# Altium project X98_CARRIER_V1R2.PrjPcb (part 1 of 3)
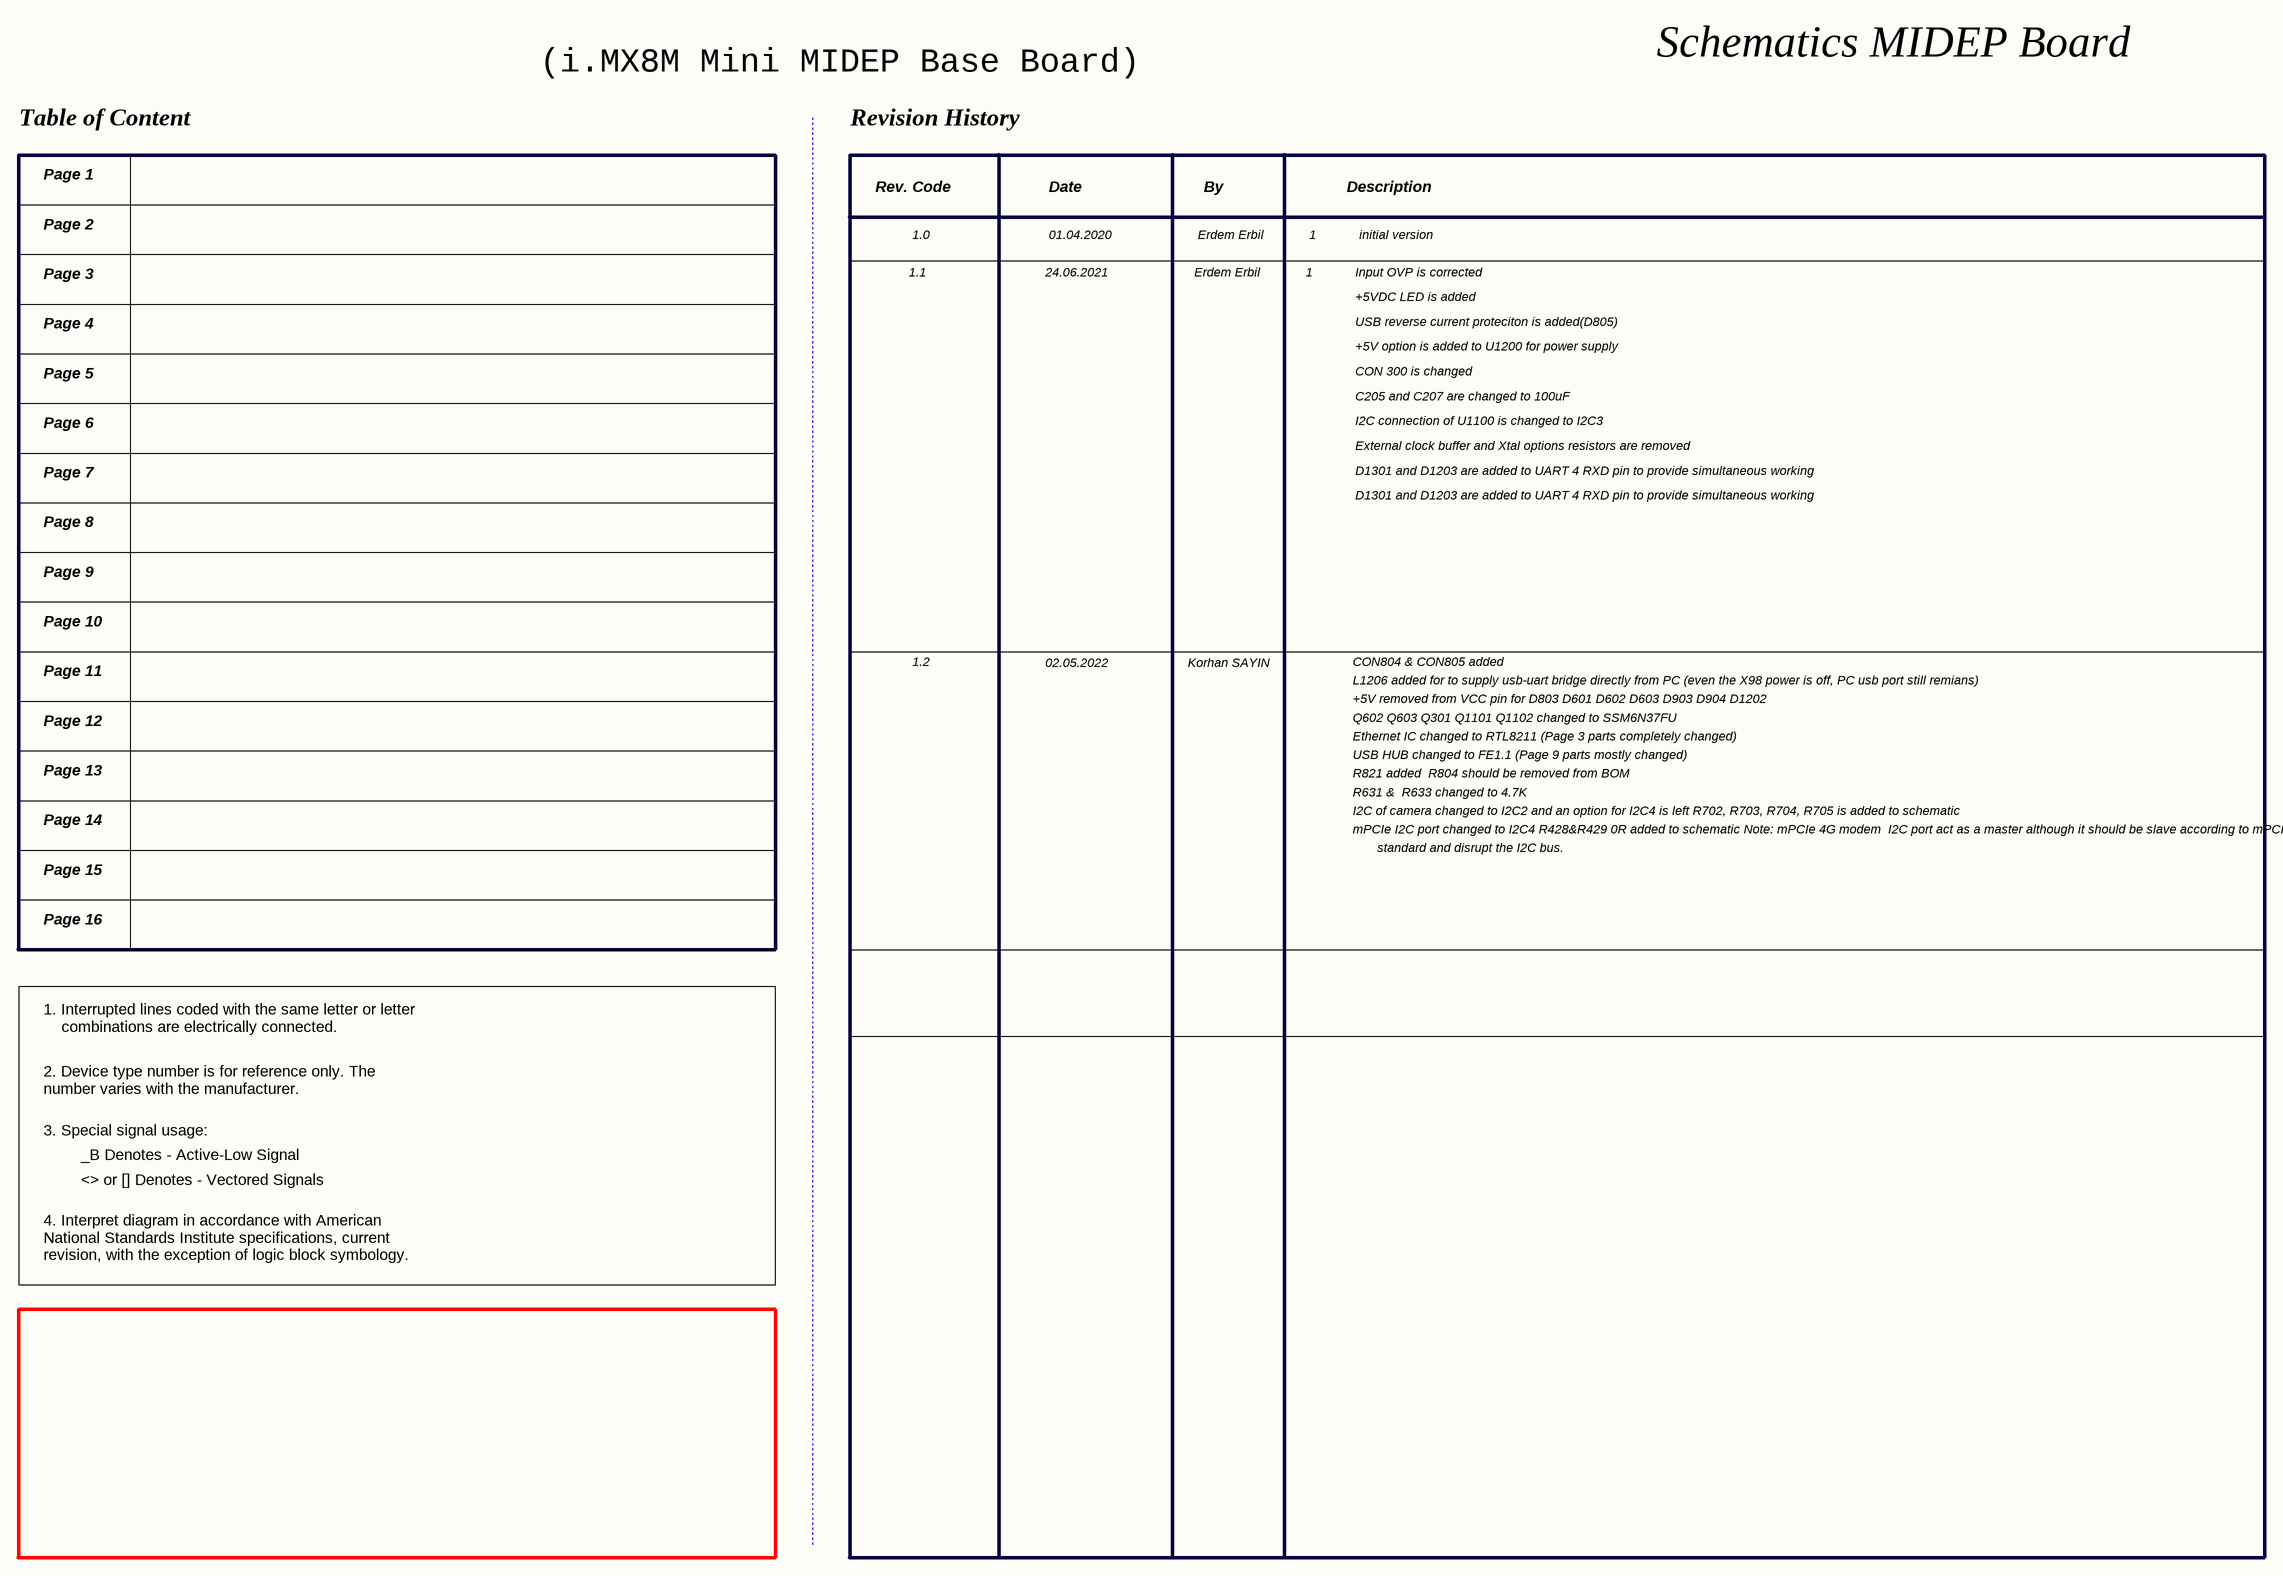
[diagram p0: 00 COVER.SchDoc]
13 sheets, 379 parts. Net scope: global (net labels, ports and power ports of the same name join across sheets).
Board file: PCB1.PcbDoc
Sheets:
  00 COVER.SchDoc
  00 BLOCK DIAGRAM.SchDoc
  MAIN.SchDoc
    Designator = 01 SoM IO INTERFACE.SchDoc
    Designator = 07 MIPI CSI.SchDoc
    Designator = 08 USB OTG & POWER.SchDoc
    Designator = 10 BOOT.SchDoc
    Designator = 05 MICROSD.SchDoc
    Designator = 06 MIPI-DSI to HDMI.SchDoc
    Designator = 12 CONSOLE.SchDoc
    Designator = 04 Custom.SchDoc
    Designator = 09 USB HUB.SchDoc
  00 PCB SPEC.SchDoc

## Sheet 00 COVER.SchDoc
size A2

### Notes on the sheet
- (i.MX8M Mini MIDEP Base Board)
- Schematics MIDEP Board
- Table of Content
- Revision History
- Page 1
- Rev. Code
- Date
- By
- Description
- Page 2
- 1.0
- 01.04.2020
- Erdem Erbil
- 1
- initial version
- Page 3
- Page 4
- 1.1
- 24.06.2021
- Input OVP is corrected
- +5VDC LED is added
- USB reverse current proteciton is added(D805)
- Page 5
- +5V option is added to U1200 for power supply
- CON 300 is changed
- Page 6
- C205 and C207 are changed to 100uF
- I2C connection of U1100 is changed to I2C3
- External clock buffer and Xtal options resistors are removed
- Page 7
- D1301 and D1203 are added to UART 4 RXD pin to provide simultaneous working
- Page 8
- Page 9
- Page 10
- Page 11
- 1.2
- 02.05.2022
- Korhan SAYIN
- CON804 & CON805 added
- L1206 added for to supply usb-uart bridge directly from PC (even the X98 power is off, PC usb port still remians)
- +5V removed from VCC pin for D803 D601 D602 D603 D903 D904 D1202
- Page 12
- Q602 Q603 Q301 Q1101 Q1102 changed to SSM6N37FU
- Ethernet IC changed to RTL8211 (Page 3 parts completely changed)
- USB HUB changed to FE1.1 (Page 9 parts mostly changed)
- Page 13
- Page 14
- R821 added  R804 should be removed from BOM
- R631 &  R633 changed to 4.7K
- I2C of camera changed to I2C2 and an option for I2C4 is left R702, R703, R704, R705 is added to schematic
- Page 15
- mPCIe I2C port changed to I2C4 R428&R429 0R added to schematic Note: mPCIe 4G modem  I2C port act as a master although it should be slave according to mPCIe
- standard and disrupt the I2C bus.
- Page 16
- 1. Interrupted lines coded with the same letter or letter
  combinations are electrically connected.
- 2. Device type number is for reference only. The
  number varies with the manufacturer.
- 3. Special signal usage:
- _B Denotes - Active-Low Signal
- <> or [] Denotes - Vectored Signals
- 4. Interpret diagram in accordance with American
  National Standards Institute specifications, current
  revision, with the exception of logic block symbology.
- Sheet Title:
- Project:
- Inventron
- Electronics and Software
- Size:
- Date:
- Drawn By:
- Revision:
- Checked By:
- A4
- Sheet
- Time:
- of
- Budotek Teknopark
- Dudullu OSB
- Des 2. Cadde No:8/30
- ©2020 Inventron Electronics and Software. All rights reserved.
- Umraniye / ISTANBUL

## Sheet 00 BLOCK DIAGRAM.SchDoc
size A3
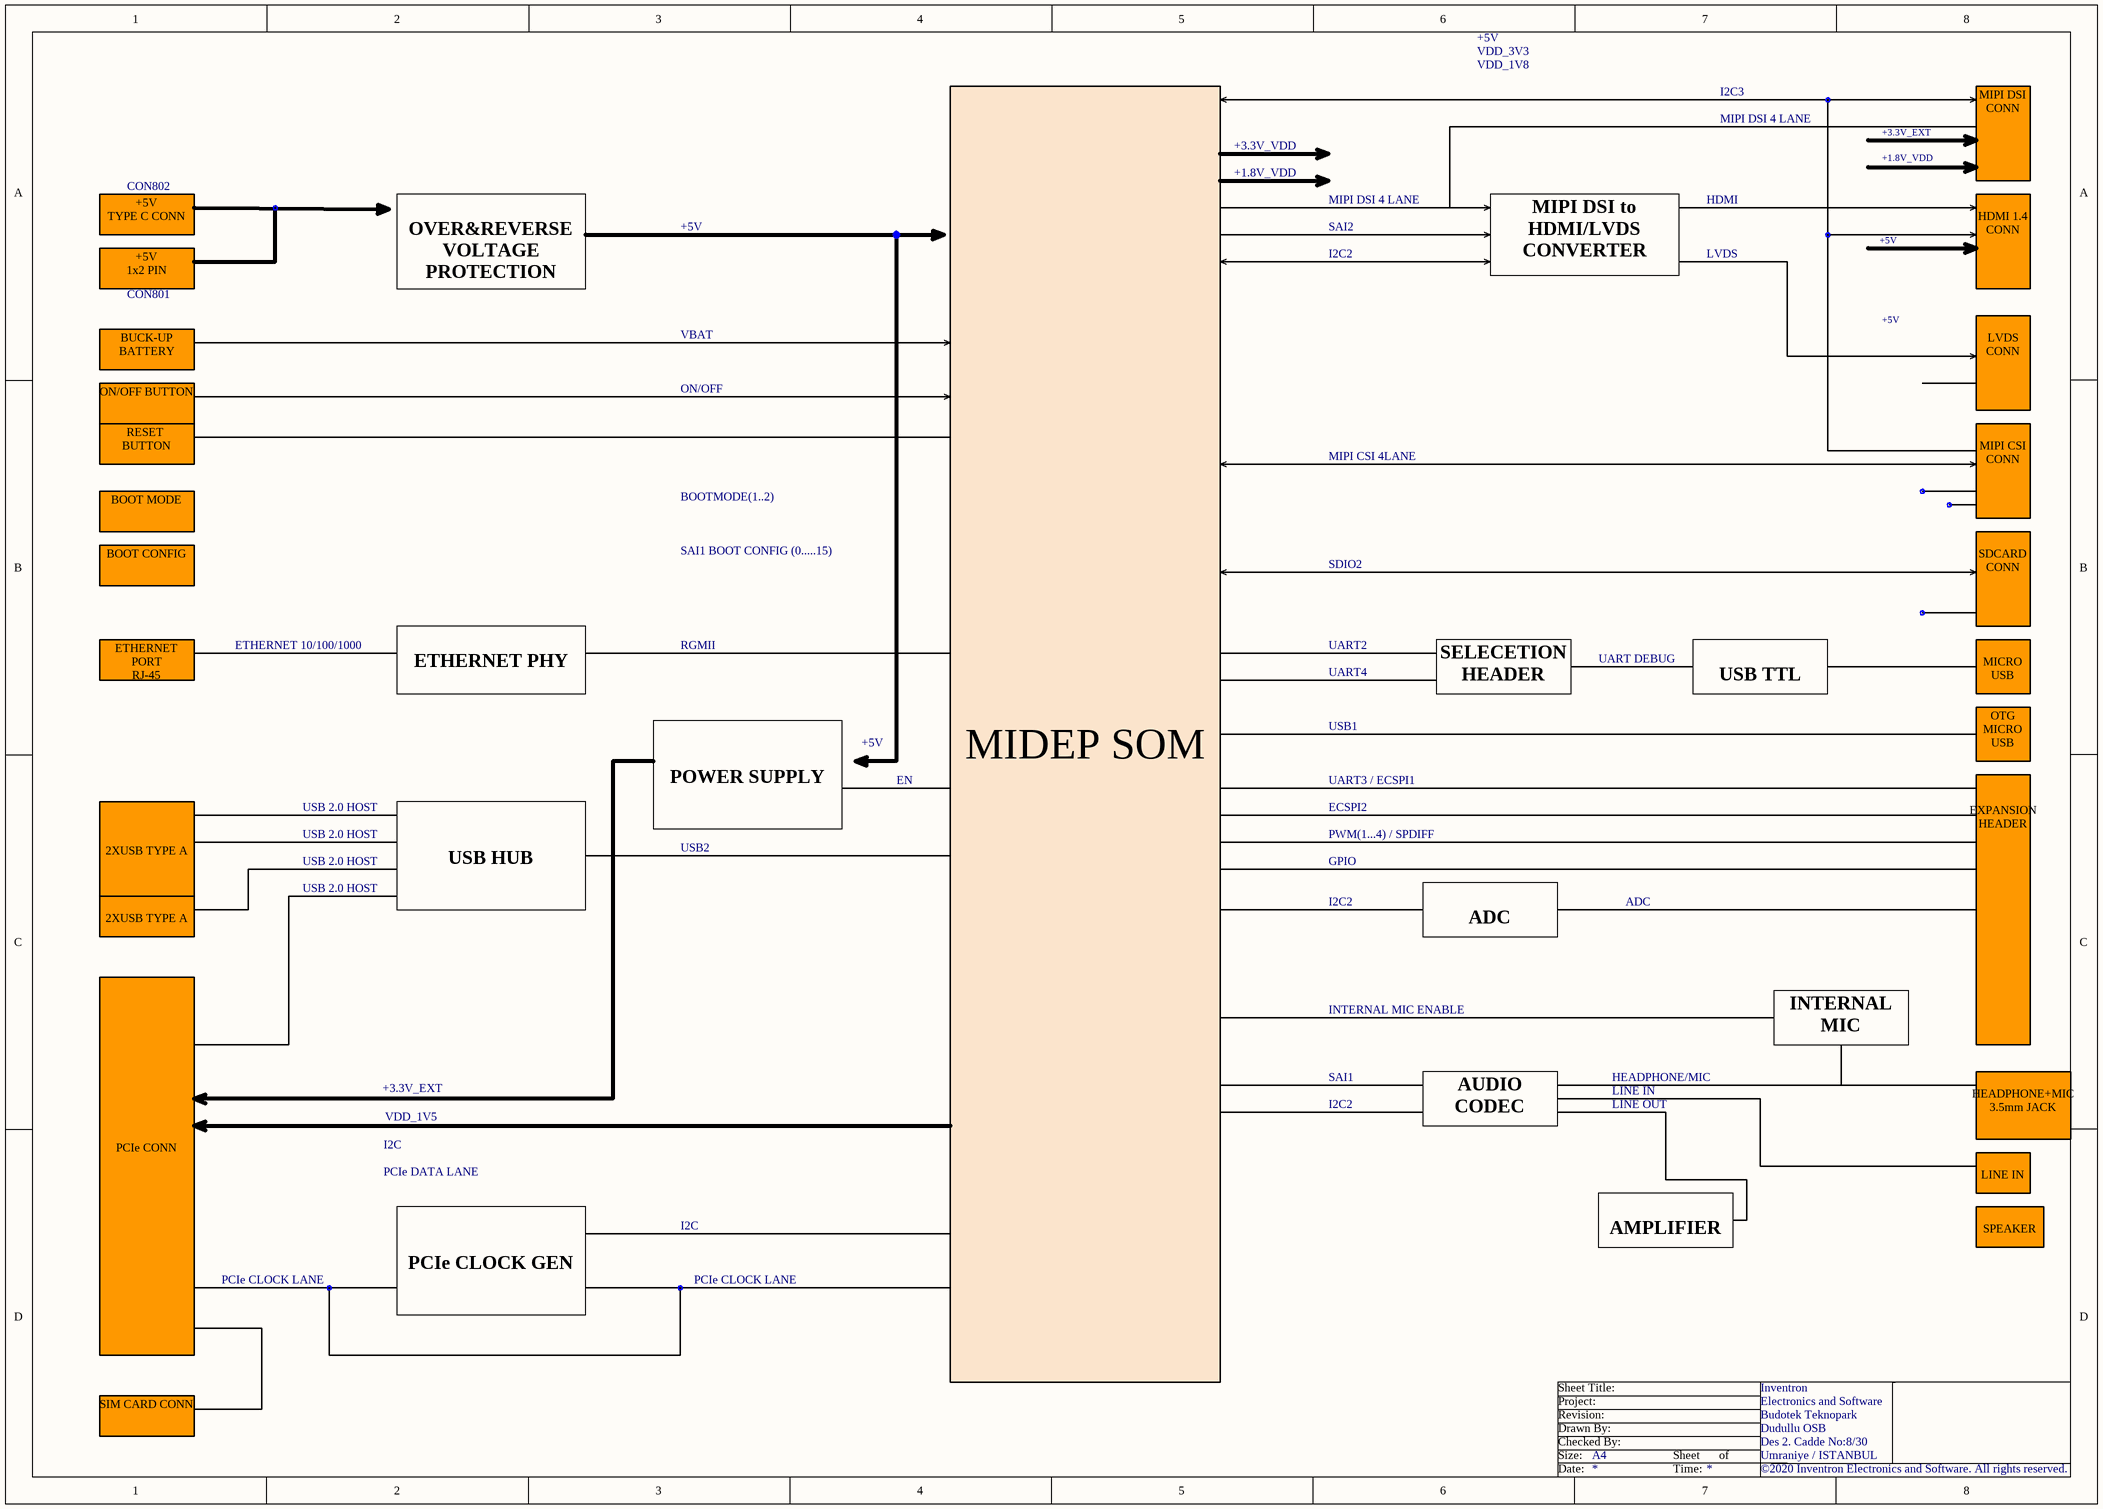
[diagram p1: 00 BLOCK DIAGRAM.SchDoc]

### Notes on the sheet
- +5V
- VDD_3V3
- VDD_1V8
- I2C3
- +3.3V_VDD
- +1.8V_VDD
- MIPI DSI 4 LANE
- +3.3V_EXT
- MIPI DSI CONN
- +5V
  TYPE C CONN
- CON802
- SAI2
- HDMI
- +5V
  1x2 PIN
- CON801
- OVER&REVERSE VOLTAGE
  PROTECTION
- I2C2
- MIPI DSI to HDMI/LVDS CONVERTER
- LVDS
- HDMI 1.4 CONN
- BUCK-UP BATTERY
- VBAT
- ON/OFF BUTTON
- ON/OFF
- LVDS CONN
- RESET
  BUTTON
- BOOTMODE(1..2)
- MIPI CSI 4LANE
- MIPI CSI CONN
- BOOT MODE
- BOOT CONFIG
- SAI1 BOOT CONFIG (0.....15)
- SDIO2
- ETHERNET 10/100/1000
- RGMII
- UART2
- SDCARD CONN
- ETHERNET PORT
  RJ-45
- ETHERNET PHY
- UART4
- SELECETION HEADER
- UART DEBUG
- USB TTL
- MICRO USB
- EN
- UART3 / ECSPI1
- USB1
- OTG
  MICRO USB
- USB 2.0 HOST
- POWER SUPPLY
- USB2
- ECSPI2
- PWM(1...4) / SPDIFF
- 2XUSB TYPE A
- USB HUB
- GPIO
- ADC
- INTERNAL MIC ENABLE
- INTERNAL MIC
- EXPANSION HEADER
- VDD_1V5
- SAI1
- AUDIO CODEC
- HEADPHONE/MIC
- LINE IN
- LINE OUT
- I2C
- PCIe DATA LANE
- HEADPHONE+MIC
  3.5mm JACK
- AMPLIFIER
- SPEAKER
- PCIe CLOCK LANE
- PCIe CLOCK GEN
- PCIe CONN
- MIDEP SOM
- SIM CARD CONN
- Sheet Title:
- Inventron
- Size:
- Drawn By:
- Revision:
- Project:
- Checked By:
- A4
- Sheet
- of
- Budotek Teknopark
- Dudullu OSB
- Des 2. Cadde No:8/30
- Umraniye / ISTANBUL
- Electronics and Software
- Date:
- Time:
- ©2020 Inventron Electronics and Software. All rights reserved.

## Sheet MAIN.SchDoc
size A3; SheetNumber: 1; SheetTotal: 11
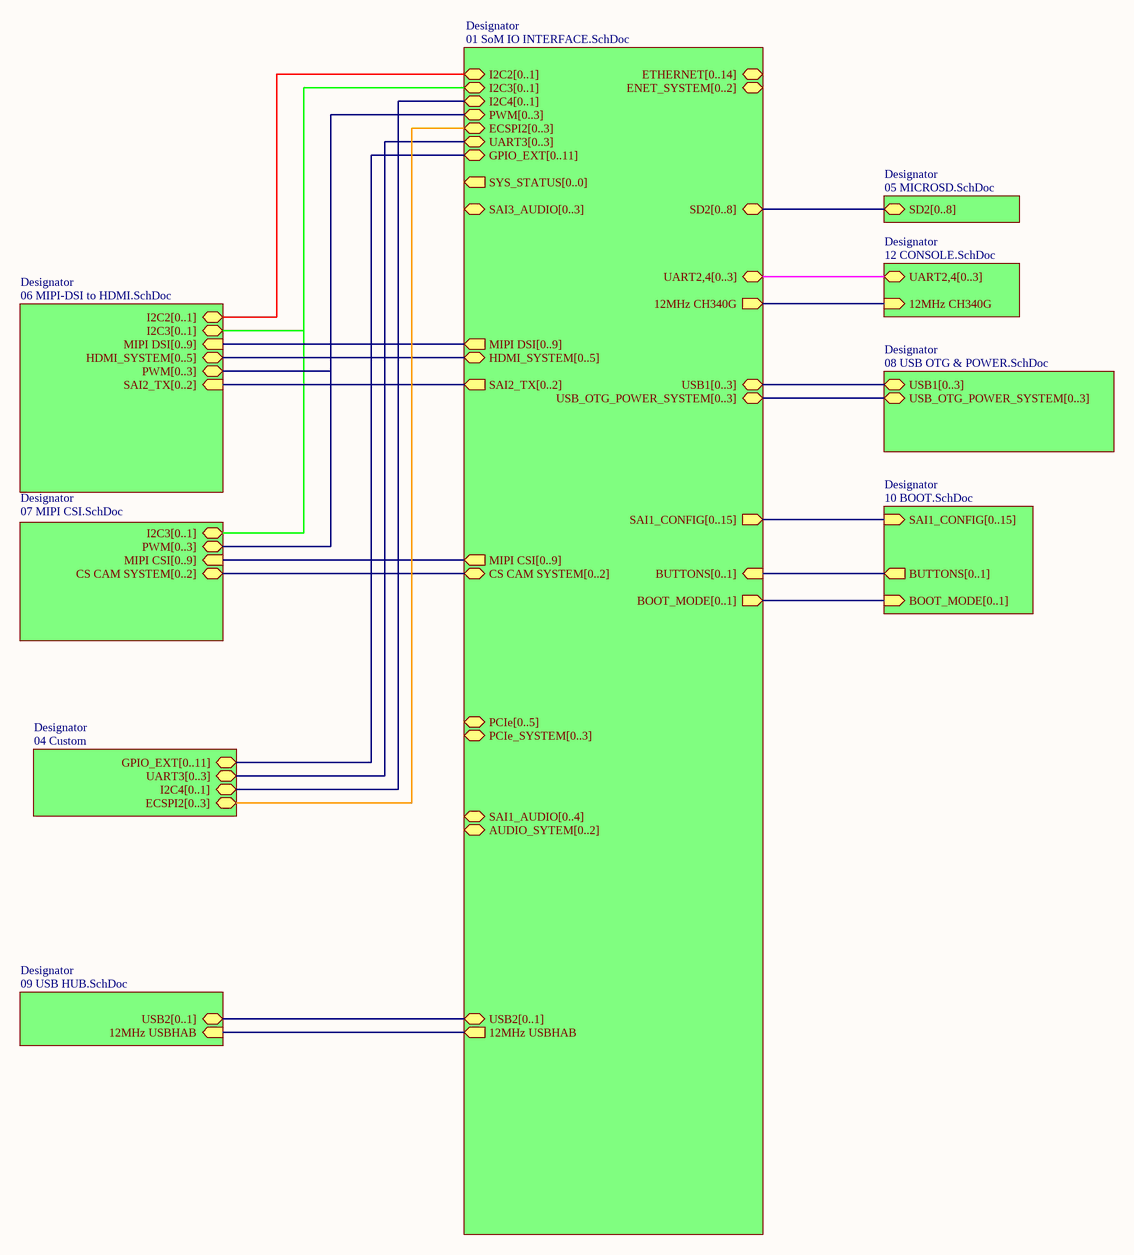
[diagram p2: MAIN.SchDoc]

### Sub-sheets
Designator = 01 SoM IO INTERFACE.SchDoc: 12MHz USBHAB (out), UART2,4[0..3] (bidir), SD2[0..8] (bidir), ETHERNET[0..14] (bidir), USB2[0..1] (bidir), MIPI DSI[0..9] (out), SAI2_TX[0..2] (out), SAI1_AUDIO[0..4] (bidir), GPIO_EXT[0..11] (bidir), MIPI CSI[0..9] (out), ECSPI2[0..3] (bidir), PCIe_SYSTEM[0..3] (bidir), PCIe[0..5] (bidir), UART3[0..3] (bidir), 12MHz CH340G (out), USB1[0..3] (bidir), SAI1_CONFIG[0..15] (out), AUDIO_SYTEM[0..2] (bidir), HDMI_SYSTEM[0..5] (bidir), CS CAM SYSTEM[0..2] (bidir), ENET_SYSTEM[0..2] (bidir), USB_OTG_POWER_SYSTEM[0..3] (bidir), I2C4[0..1] (bidir), I2C2[0..1] (bidir), I2C3[0..1] (bidir), BUTTONS[0..1] (in), SYS_STATUS[0..0] (out), BOOT_MODE[0..1] (out), SAI3_AUDIO[0..3] (bidir), PWM[0..3] (bidir)
Designator = 07 MIPI CSI.SchDoc: MIPI CSI[0..9] (in), I2C3[0..1] (bidir), CS CAM SYSTEM[0..2] (bidir), PWM[0..3] (bidir)
Designator = 08 USB OTG & POWER.SchDoc: USB1[0..3] (bidir), USB_OTG_POWER_SYSTEM[0..3] (bidir)
Designator = 10 BOOT.SchDoc: SAI1_CONFIG[0..15] (in), BUTTONS[0..1] (out), BOOT_MODE[0..1] (in)
Designator = 05 MICROSD.SchDoc: SD2[0..8] (bidir)
Designator = 06 MIPI-DSI to HDMI.SchDoc: SAI2_TX[0..2] (in), I2C3[0..1] (bidir), I2C2[0..1] (bidir), MIPI DSI[0..9] (in), HDMI_SYSTEM[0..5] (bidir), PWM[0..3] (bidir)
Designator = 12 CONSOLE.SchDoc: 12MHz CH340G (in), UART2,4[0..3] (bidir)
Designator = 04 Custom: GPIO_EXT[0..11] (bidir), UART3[0..3] (bidir), I2C4[0..1] (bidir), ECSPI2[0..3] (bidir)
Designator = 09 USB HUB.SchDoc: USB2[0..1] (bidir), 12MHz USBHAB (in)

### Nets
(unnamed): sheet Designator/12MHz USBHAB, sheet Designator/12MHz USBHAB
(unnamed): sheet Designator/12MHz CH340G, sheet Designator/12MHz CH340G

### Notes on the sheet
- Sheet Title:
- Inventron
- Size:
- Drawn By:
- Revision:
- Project:
- Checked By:
- A4
- Sheet
- of
- Budotek Teknopark
- Dudullu OSB
- Des 2. Cadde No:8/30
- Umraniye / ISTANBUL
- Electronics and Software
- Date:
- Time:
- ©2020 Inventron Electronics and Software. All rights reserved.

## Sheet 01 SoM IO INTERFACE.SchDoc
size A2; SheetNumber: 2; SheetTotal: 10
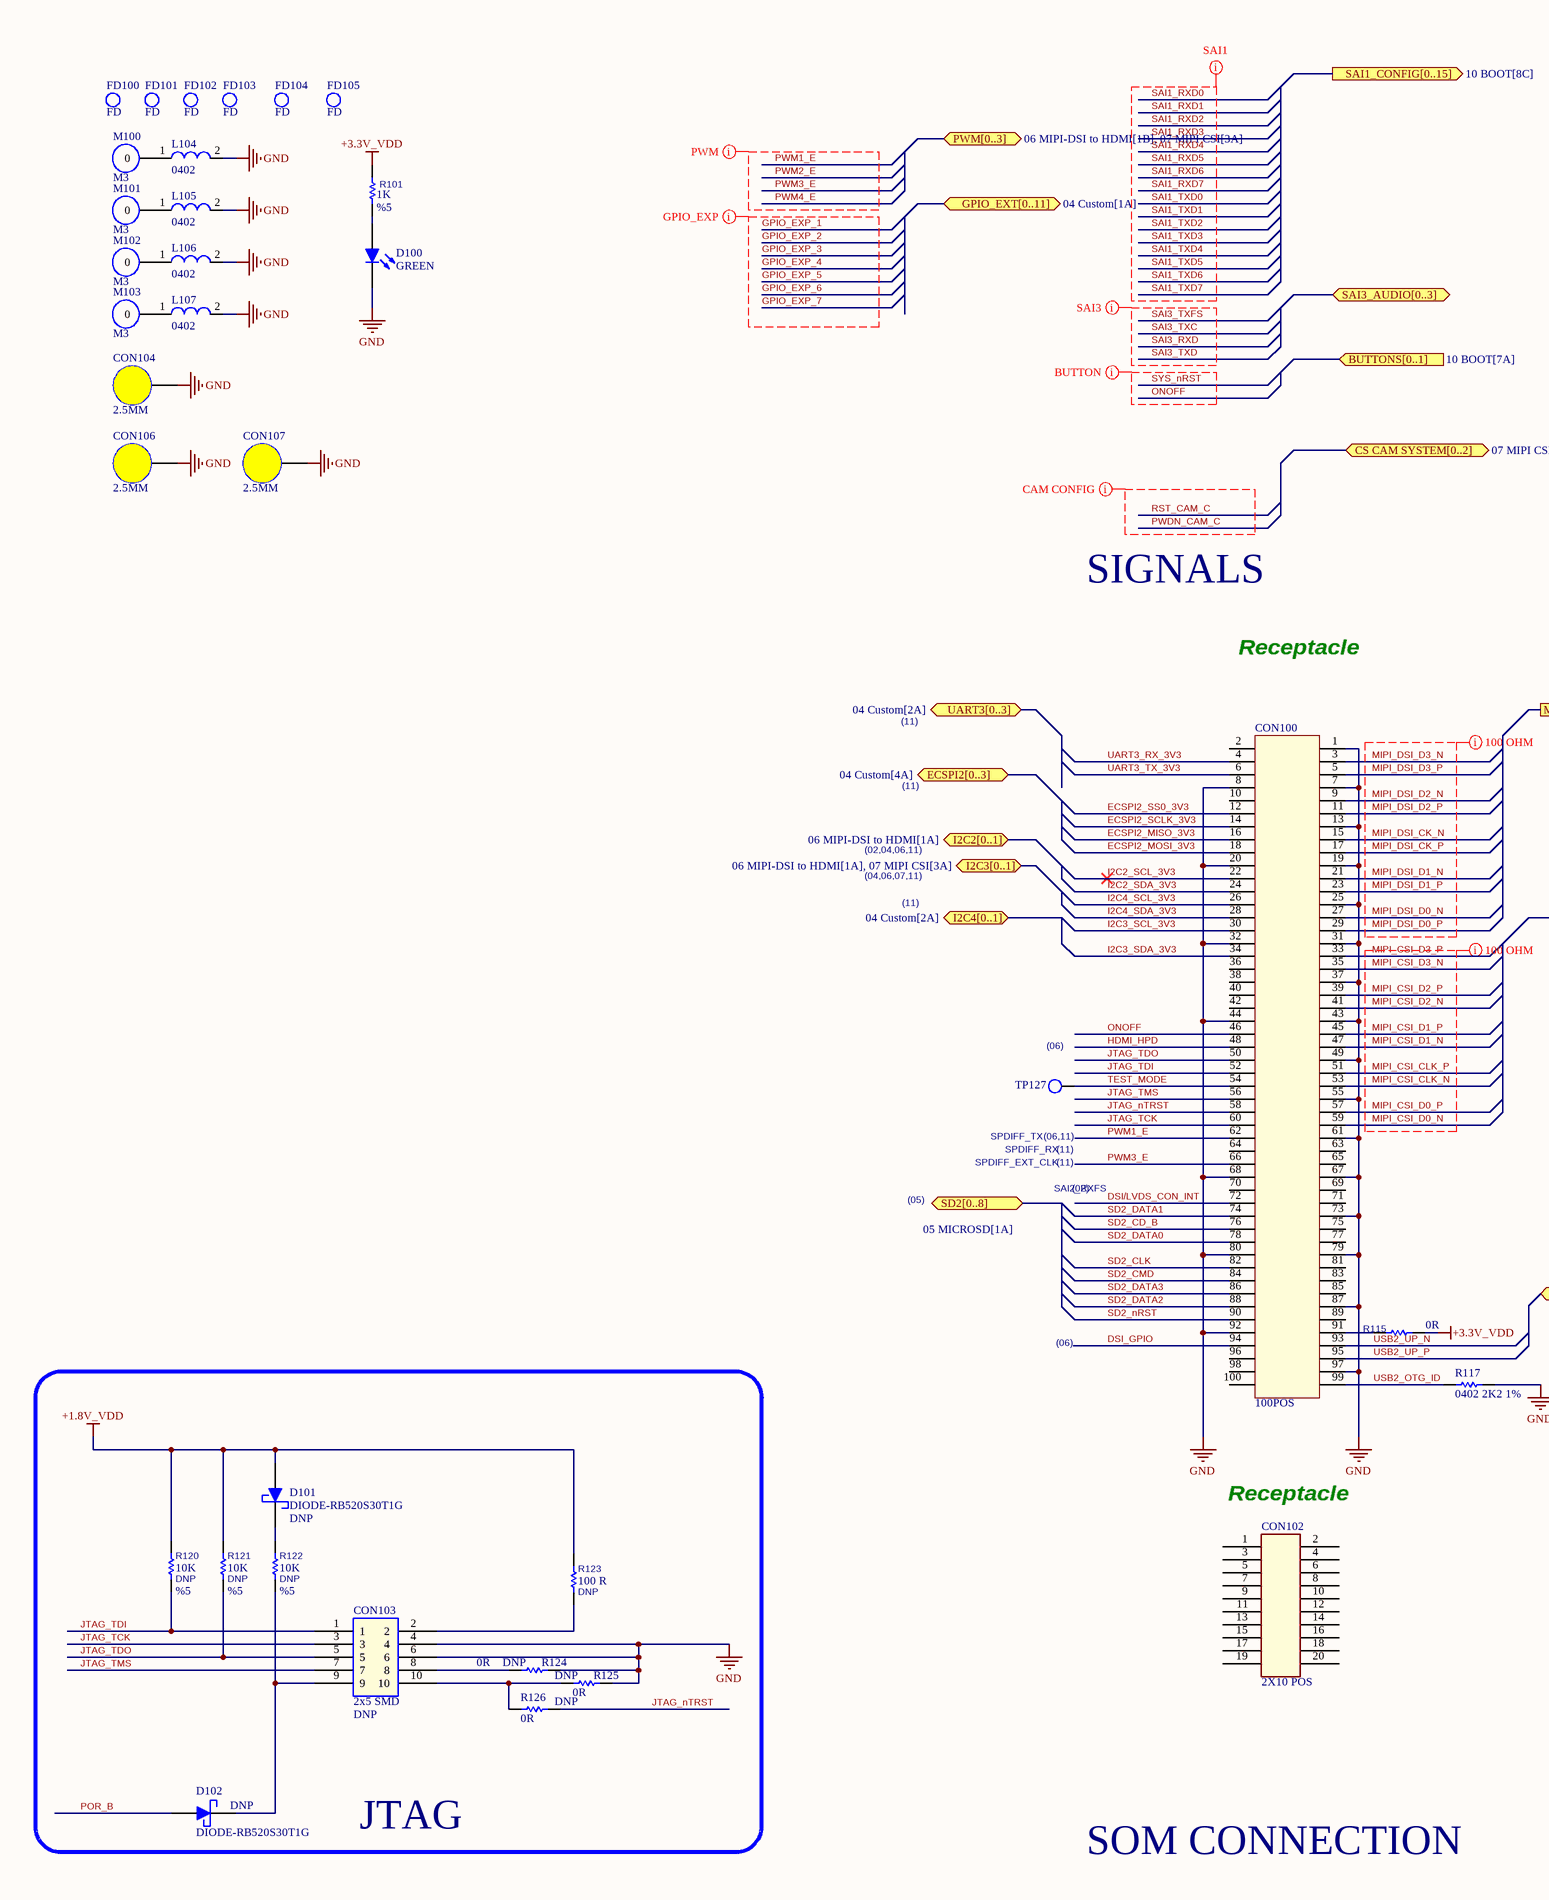
[diagram p3: 01 SoM IO INTERFACE.SchDoc, left]
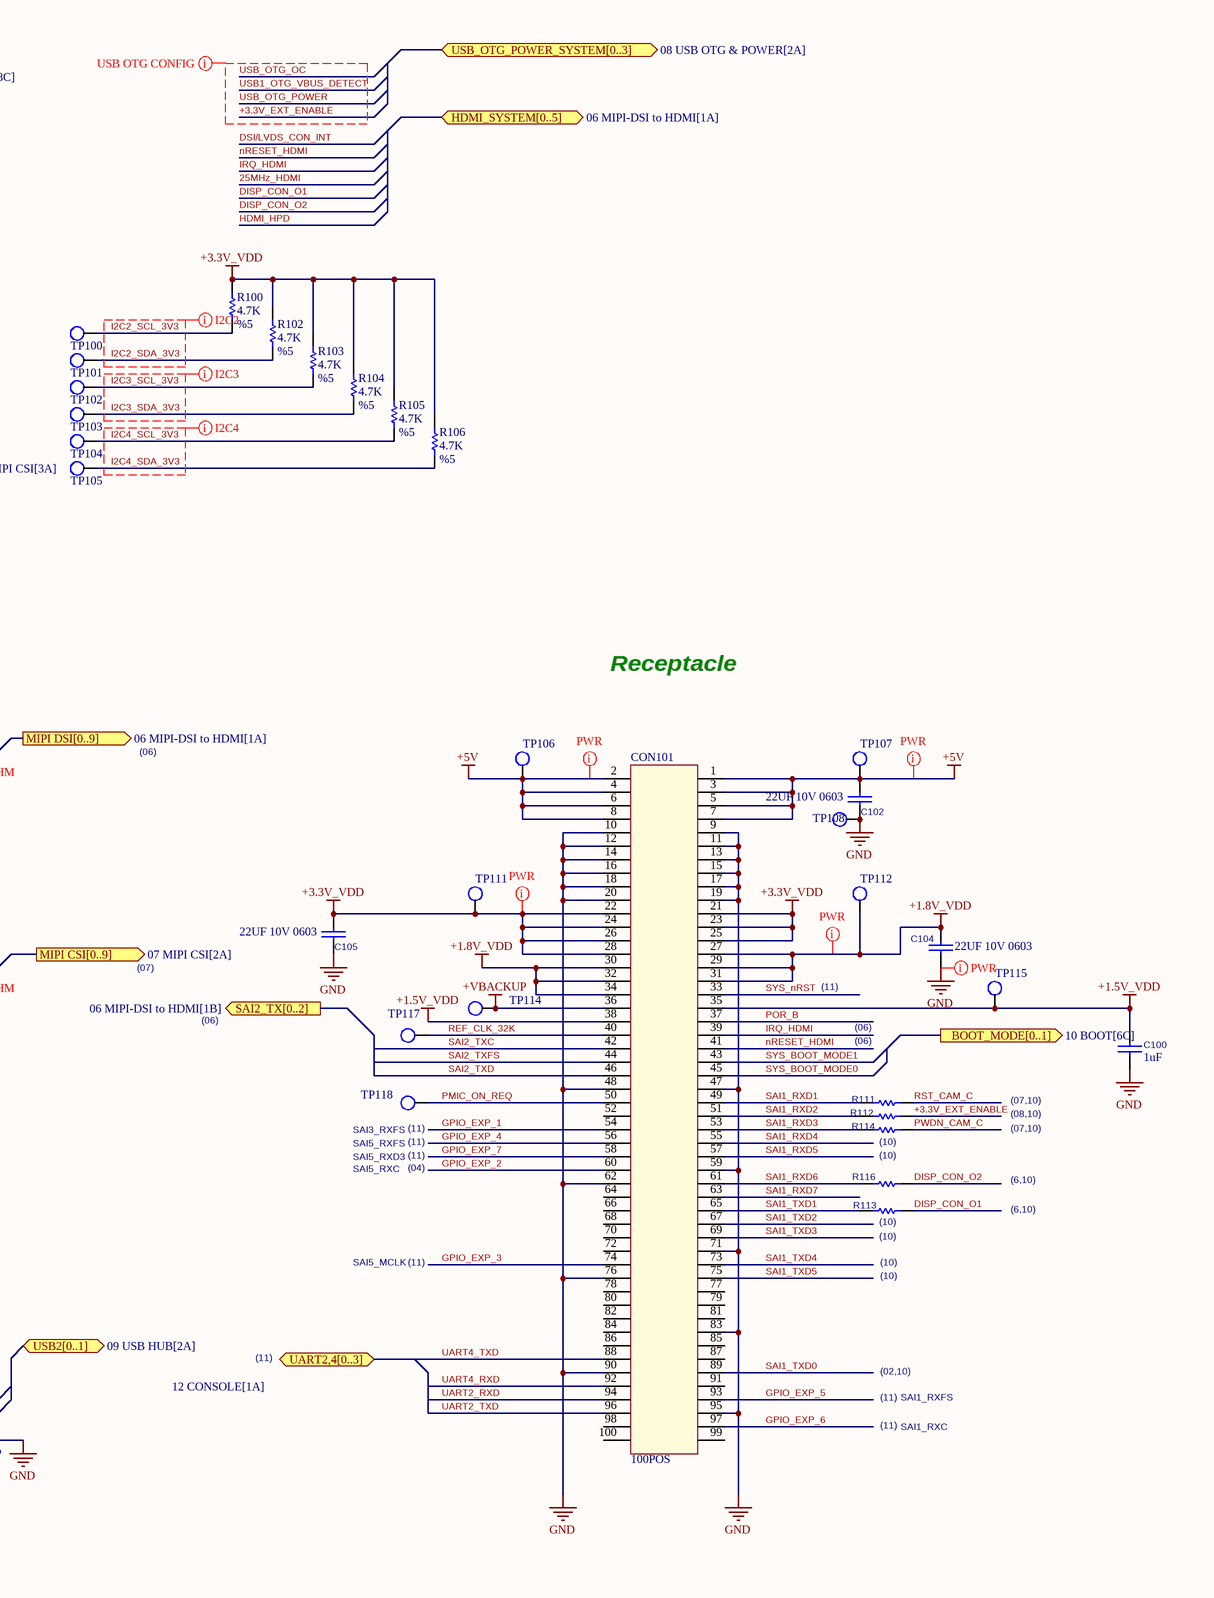
[diagram p4: 01 SoM IO INTERFACE.SchDoc, right]

### Parts
C100  1uF  [0603_CC]
C102  22UF 10V 0603  [0603_CC]
C104  22UF 10V 0603  [0603_CC]
C105  22UF 10V 0603  [0603_CC]
CON100  100POS  [DF40C-100DS- FEMALE]
CON101  100POS  [DF40C-100DS- FEMALE]
CON102  2X10 POS  [DF40C-20DS-0.4V(51)]
CON103  2x5 SMD  ASSY_OPT: DNP  [HEADER 2X5 1.27MM THD]  (no BOM)
CON104  2.5MM  [9774030151R]
CON106  2.5MM  [9774030151R]
CON107  2.5MM  [9774030151R]
D100  GREEN  [0603_LED]
D101  DIODE-RB520S30T1G  ASSY_OPT: DNP  [SOD523]  (no BOM)
D102  DIODE-RB520S30T1G  ASSY_OPT: DNP  [SOD523]  (no BOM)
FD100  FD  [FD]
FD101  FD  [FD]
FD102  FD  [FD]
FD103  FD  [FD]
FD104  FD  [FD]
FD105  FD  [FD]
L104  0402  [0402_RES]
L105  0402  [0402_RES]
L106  0402  [0402_RES]
L107  0402  [0402_RES]
M100  M3  [M3]  (no BOM)
M101  M3  [M3]  (no BOM)
M102  M3  [M3]  (no BOM)
M103  M3  [M3]  (no BOM)
R100  4.7K  Tolerance: %5  [0402_RES]
R101  1K  Tolerance: %5  [0402_RES]
R102  4.7K  Tolerance: %5  [0402_RES]
R103  4.7K  Tolerance: %5  [0402_RES]
R104  4.7K  Tolerance: %5  [0402_RES]
R105  4.7K  Tolerance: %5  [0402_RES]
R106  4.7K  Tolerance: %5  [0402_RES]
R111  0402 330R 5%  [0402_RES]  (value not drawn)
R112  0402 330R 5%  [0402_RES]  (value not drawn)
R113  0402 330R 5%  [0402_RES]  (value not drawn)
R114  0402 330R 5%  [0402_RES]  (value not drawn)
R115  0R  [0402_RES]
R116  0402 330R 5%  [0402_RES]  (value not drawn)
R117  0402 2K2 1%  [0402_RES]
R120  10K  ASSY_OPT: DNP  Tolerance: %5  [0402_RES]  (no BOM)
R121  10K  ASSY_OPT: DNP  Tolerance: %5  [0402_RES]  (no BOM)
R122  10K  ASSY_OPT: DNP  Tolerance: %5  [0402_RES]  (no BOM)
R123  100 R  ASSY_OPT: DNP  [0603_RES]  (no BOM)
R124  0R  ASSY_OPT: DNP  [0402_RES]  (no BOM)
R125  0R  ASSY_OPT: DNP  [0402_RES]  (no BOM)
R126  0R  ASSY_OPT: DNP  [0402_RES]  (no BOM)
TP100  TEST POINT 35  [testpoint_35mil]  (value not drawn)  (no BOM)
TP101  TEST POINT 35  [testpoint_35mil]  (value not drawn)  (no BOM)
TP102  TEST POINT 35  [testpoint_35mil]  (value not drawn)  (no BOM)
TP103  TEST POINT 35  [testpoint_35mil]  (value not drawn)  (no BOM)
TP104  TEST POINT 35  [testpoint_35mil]  (value not drawn)  (no BOM)
TP105  TEST POINT 35  [testpoint_35mil]  (value not drawn)  (no BOM)
TP106  TEST POINT 35  [testpoint_35mil]  (value not drawn)  (no BOM)
TP107  TEST POINT 35  [testpoint_35mil]  (value not drawn)  (no BOM)
TP108  TEST POINT 35  [testpoint_35mil]  (value not drawn)  (no BOM)
TP111  TEST POINT 35  [testpoint_35mil]  (value not drawn)  (no BOM)
TP112  TEST POINT 35  [testpoint_35mil]  (value not drawn)  (no BOM)
TP114  TEST POINT 35  [testpoint_35mil]  (value not drawn)  (no BOM)
TP115  TEST POINT 35  [testpoint_35mil]  (value not drawn)  (no BOM)
TP117  TEST POINT 15  [testpoint_15]  (value not drawn)  (no BOM)
TP118  TEST POINT 15  [testpoint_15]  (value not drawn)  (no BOM)
TP127  TEST POINT 35  [testpoint_35mil]  (value not drawn)  (no BOM)

### Blocks framed on the sheet
JTAG: CON103 D101 D102 R120-R126

### Ports
BOOT_MODE[0..1] (out, see 10 BOOT[6C]), BUTTONS[0..1] (in, see 10 BOOT[7A]), CS CAM SYSTEM[0..2] (bidir, see 07 MIPI CSI[3A]), ECSPI2[0..3] (bidir, see 04 Custom[4A]), GPIO_EXT[0..11] (bidir, see 04 Custom[1A]), HDMI_SYSTEM[0..5] (bidir, see 06 MIPI-DSI to HDMI[1A]), I2C2[0..1] (bidir, see 06 MIPI-DSI to HDMI[1A]), I2C3[0..1] (bidir, see 06 MIPI-DSI to HDMI[1A], 07 MIPI CSI[3A]), I2C4[0..1] (bidir, see 04 Custom[2A]), MIPI CSI[0..9] (out, see 07 MIPI CSI[2A]), MIPI DSI[0..9] (out, see 06 MIPI-DSI to HDMI[1A]), PWM[0..3] (bidir, see 06 MIPI-DSI to HDMI[1B], 07 MIPI CSI[3A]), SAI1_CONFIG[0..15] (out, see 10 BOOT[8C]), SAI2_TX[0..2] (out, see 06 MIPI-DSI to HDMI[1B]), SAI3_AUDIO[0..3] (bidir), SD2[0..8] (bidir, see 05 MICROSD[1A]), UART2,4[0..3] (bidir, see 12 CONSOLE[1A]), UART3[0..3] (bidir, see 04 Custom[2A]), USB2[0..1] (bidir, see 09 USB HUB[2A]), USB_OTG_POWER_SYSTEM[0..3] (bidir, see 08 USB OTG & POWER[2A])

### Nets
+1.5V_VDD: C100.2 CON101.35(P35) CON101.38(P38) TP115.1
+1.8V_VDD: C104.1 CON101.27(P27) CON101.29(P29) CON101.30(P30) CON101.31(P31) CON101.32(P32) CON101.34(P34) D101.1(A) R120.2 R121.2 R123.2 TP112.1
+3.3V_VDD: C105.1 CON101.21(P21) CON101.22(P22) CON101.23(P23) CON101.24(P24) CON101.25(P25) CON101.26(P26) CON101.28(P28) R100.2 R101.1 R102.2 R103.2 R104.2 R105.2 R106.2 R115.1 TP111.1
+5V: C102.1 CON101.1(P1) CON101.2(P2) CON101.3(P3) CON101.4(P4) CON101.5(P5) CON101.6(P6) CON101.7(P7) CON101.8(P8) TP106.1 TP107.1
+VBACKUP: CON101.36(P36) TP114.1
GND: C100.1 C102.2 C104.2 C105.2 CON100.1(P1) CON100.7(P7) CON100.8(P8) CON100.13(P13) CON100.19(P19) CON100.20(P20) CON100.25(P25) CON100.31(P31) CON100.32(P32) CON100.37(P37) CON100.43(P43) CON100.44(P44) CON100.49(P49) CON100.55(P55) CON100.61(P61) CON100.67(P67) CON100.68(P68) CON100.73(P73) CON100.79(P79) CON100.80(P80) CON100.87(P87) CON100.92(P92) CON100.97(P97) CON101.9(P9) CON101.10(P10) CON101.11(P11) CON101.12(P12) CON101.13(P13) CON101.14(P14) CON101.15(P15) CON101.16(P16) CON101.17(P17) CON101.18(P18) CON101.19(P19) CON101.20(P20) CON101.47(P47) CON101.48(P48) CON101.59(P59) CON101.62(P62) CON101.71(P71) CON101.76(P76) CON101.83(P83) CON101.90(P90) CON101.95(P95) CON103.4 CON103.6 CON104.0 CON106.0 CON107.0 D100.2(K) L104.2 L105.2 L106.2 L107.2 R117.2 R124.2 R125.2 TP108.1
+3.3V_EXT_ENABLE: R112.2
DISP_CON_O1: R113.1
DISP_CON_O2: R116.1
DSI/LVDS_CON_INT: CON100.72(P72)
DSI_GPIO: CON100.94(P94)
ECSPI2_MISO_3V3: CON100.16(P16)
ECSPI2_MOSI_3V3: CON100.18(P18)
ECSPI2_SCLK_3V3: CON100.14(P14)
ECSPI2_SS0_3V3: CON100.12(P12)
GPIO_EXP_1: CON101.54(P54)
GPIO_EXP_2: CON101.60(P60)
GPIO_EXP_3: CON101.74(P74)
GPIO_EXP_4: CON101.56(P56)
GPIO_EXP_5: CON101.93(P93)
GPIO_EXP_6: CON101.97(P97)
GPIO_EXP_7: CON101.58(P58)
HDMI_HPD: CON100.48(P48)
I2C2_SCL_3V3: CON100.22(P22) R100.1 TP100.1
I2C2_SDA_3V3: CON100.24(P24) R102.1 TP101.1
I2C3_SCL_3V3: CON100.30(P30) R103.1 TP102.1
I2C3_SDA_3V3: CON100.34(P34) R104.1 TP103.1
I2C4_SCL_3V3: CON100.26(P26) R105.1 TP104.1
I2C4_SDA_3V3: CON100.28(P28) R106.1 TP105.1
IRQ_HDMI: CON101.39(P39)
JTAG_nTRST: CON100.58(P58) R126.2
JTAG_TCK: CON100.60(P60) CON103.3
JTAG_TDI: CON100.52(P52) CON103.1 R120.1
JTAG_TDO: CON100.50(P50) CON103.5 R121.1
JTAG_TMS: CON100.56(P56) CON103.7
MIPI_CSI_CLK_N: CON100.53(P53)
MIPI_CSI_CLK_P: CON100.51(P51)
MIPI_CSI_D0_N: CON100.59(P59)
MIPI_CSI_D0_P: CON100.57(P57)
MIPI_CSI_D1_N: CON100.47(P47)
MIPI_CSI_D1_P: CON100.45(P45)
MIPI_CSI_D2_N: CON100.41(P41)
MIPI_CSI_D2_P: CON100.39(P39)
MIPI_CSI_D3_N: CON100.35(P35)
MIPI_CSI_D3_P: CON100.33(P33)
MIPI_DSI_CK_N: CON100.15(P15)
MIPI_DSI_CK_P: CON100.17(P17)
MIPI_DSI_D0_N: CON100.27(P27)
MIPI_DSI_D0_P: CON100.29(P29)
MIPI_DSI_D1_N: CON100.21(P21)
MIPI_DSI_D1_P: CON100.23(P23)
MIPI_DSI_D2_N: CON100.9(P9)
MIPI_DSI_D2_P: CON100.11(P11)
MIPI_DSI_D3_N: CON100.3(P3)
MIPI_DSI_D3_P: CON100.5(P5)
nRESET_HDMI: CON101.41(P41)
ONOFF: CON100.46(P46)
PMIC_ON_REQ: CON101.50(P50) TP118.1
POR_B: CON101.37(P37) D102.1(A)
PWDN_CAM_C: R114.2
PWM1_E: CON100.62(P62)
PWM3_E: CON100.66(P66)
REF_CLK_32K: CON101.40(P40) TP117.1
RST_CAM_C: R111.2
SAI1_RXD1: CON101.49(P49) R111.1
SAI1_RXD2: CON101.51(P51) R112.1
SAI1_RXD3: CON101.53(P53) R114.1
SAI1_RXD4: CON101.55(P55)
SAI1_RXD5: CON101.57(P57)
SAI1_RXD6: CON101.61(P61) R116.2
SAI1_RXD7: CON101.63(P63)
SAI1_TXD0: CON101.89(P89)
SAI1_TXD1: CON101.65(P65) R113.2
SAI1_TXD2: CON101.67(P67)
SAI1_TXD3: CON101.69(P69)
SAI1_TXD4: CON101.73(P73)
SAI1_TXD5: CON101.75(P75)
SAI2_TXC: CON101.42(P42)
SAI2_TXD: CON101.46(P46)
SAI2_TXFS: CON101.44(P44)
SD2_CD_B: CON100.76(P76)
SD2_CLK: CON100.82(P82)
SD2_CMD: CON100.84(P84)
SD2_DATA0: CON100.78(P78)
SD2_DATA1: CON100.74(P74)
SD2_DATA2: CON100.88(P88)
SD2_DATA3: CON100.86(P86)
SD2_nRST: CON100.90(P90)
SYS_BOOT_MODE0: CON101.45(P45)
SYS_BOOT_MODE1: CON101.43(P43)
SYS_nRST: CON101.33(P33)
TEST_MODE: CON100.54(P54) TP127.1
UART2_RXD: CON101.94(P94)
UART2_TXD: CON101.96(P96)
UART3_RX_3V3: CON100.4(P4)
UART3_TX_3V3: CON100.6(P6)
UART4_RXD: CON101.92(P92)
UART4_TXD: CON101.88(P88)
USB2_OTG_ID: CON100.99(P99) R117.1
USB2_UP_N: CON100.93(P93)
USB2_UP_P: CON100.95(P95)
NetCON100_91: CON100.91(P91) R115.2
NetCON103_2: CON103.2 R123.1
NetCON103_8: CON103.8 R124.1
NetCON103_9: CON103.9 D102.2(K) R122.1
NetCON103_10: CON103.10 R125.1 R126.1
NetD100_1: D100.1(A) R101.2
NetD101_2: D101.2(K) R122.2
NetL104_1: L104.1 M100.0
NetL105_1: L105.1 M101.0
NetL106_1: L106.1 M102.0
NetL107_1: L107.1 M103.0

Not connected (* = marked no-connect by the designer): CON100 2(P2) 10(P10) 36(P36) 38(P38) 40(P40) 42(P42) 63(P63) 64(P64) 65(P65) 69(P69) 70(P70) 71(P71) 75(P75) 77(P77) 81(P81) 83(P83) 85(P85) 89(P89) 96(P96) 98(P98) 100(P100); CON101 52(P52) 64(P64) 66(P66) 68(P68) 70(P70) 72(P72) 77(P77) 78(P78) 79(P79) 80(P80) 81(P81) 82(P82) 84(P84) 85(P85) 86(P86) 87(P87) 91(P91) 98(P98) 99(P99) 100(P100); CON102 1 2 3 4 5 6 7 8 9 10 11 12 13 14 15 16 17 18 19 20

### Layout directives
differential pair; differential pair class DIFF DSI 100 OHM; net class MIPI DSI: MIPI_DSI_CK_N, MIPI_DSI_CK_P, MIPI_DSI_D0_N, MIPI_DSI_D0_P, MIPI_DSI_D1_N, MIPI_DSI_D1_P, MIPI_DSI_D2_N, MIPI_DSI_D2_P, MIPI_DSI_D3_N, MIPI_DSI_D3_P
differential pair; differential pair class DIFF CSI 100 OHM; net class MIPI CSI: MIPI_CSI_CLK_N, MIPI_CSI_CLK_P, MIPI_CSI_D0_N, MIPI_CSI_D0_P, MIPI_CSI_D1_N, MIPI_CSI_D1_P, MIPI_CSI_D2_N, MIPI_CSI_D2_P, MIPI_CSI_D3_N, MIPI_CSI_D3_P
net class SAI1: SAI1_RXD0, SAI1_RXD1, SAI1_RXD2, SAI1_RXD3, SAI1_RXD4, SAI1_RXD5, SAI1_RXD6, SAI1_RXD7, SAI1_TXD0, SAI1_TXD1, SAI1_TXD2, SAI1_TXD3, SAI1_TXD4, SAI1_TXD5, SAI1_TXD6, SAI1_TXD7
net class PWM: PWM1_E, PWM2_E, PWM3_E, PWM4_E
net class GPIO_EXP: GPIO_EXP_1, GPIO_EXP_2, GPIO_EXP_3, GPIO_EXP_4, GPIO_EXP_5, GPIO_EXP_6, GPIO_EXP_7
net class CAM CONFIG: PWDN_CAM_C, RST_CAM_C
net class SAI3: SAI3_RXD, SAI3_TXC, SAI3_TXD, SAI3_TXFS
net class BUTTON: ONOFF, SYS_nRST
net class USB OTG CONFIG: +3.3V_EXT_ENABLE, USB1_OTG_VBUS_DETECT, USB_OTG_OC, USB_OTG_POWER
net class I2C2: I2C2_SCL_3V3, I2C2_SDA_3V3
net class I2C3: I2C3_SCL_3V3, I2C3_SDA_3V3
net class I2C4: I2C4_SCL_3V3, I2C4_SDA_3V3
net class PWR: +1.8V_VDD, +3.3V_VDD, +5V, GND

### Notes on the sheet
- SIGNALS
- Receptacle
- (11)
- (06)
- (02,04,06,11)
- (04,06,07,11)
- (07)
- (near TP115) (03)
- (near TP127) (06)
- (08,10)
- (07,10)
- SPDIFF_TX
- (near TP127) (06,11)
- (near TP118) SAI5_RXD3
- (near TP118) SAI3_RXFS
- (near TP118) SAI5_RXFS
- SAI5_RXC
- (near TP118) (11)
- (04)
- (near R114) (10)
- (10)
- (6,10)
- (05)
- SPDIFF_EXT_CLK
- SPDIFF_RX
- SAI2_RXFS
- (02)
- (near R113) (10)
- SAI5_MCLK
- (02,10)
- SAI1_RXFS
- SAI1_RXC
- (near CON102) Receptacle
- SOM CONNECTION
- Sheet Title:
- Project:
- Inventron
- Electronics and Software
- Size:
- Date:
- Drawn By:
- Revision:
- Checked By:
- A4
- Sheet
- Time:
- of
- Budotek Teknopark
- Dudullu OSB
- Des 2. Cadde No:8/30
- ©2020 Inventron Electronics and Software. All rights reserved.
- Umraniye / ISTANBUL

### Library data of the parts
C100 = CAP-CL10B105KA8NNNC: CAP CER 1UF 25V X7R 0603; Manufacturer-1: SAMSUNG; Class: Capacitor; Manufacturer Part Number-1: CL10B105KA8NNNC; Footprint: *; Manufacturer-2: *; Manufacturer Part Number-2: *; Inventron Stock No: *; Created By: LA; Created Date: *; Checked By: *; ASSY_OPT: *; Dimensions: *; Unit Price: *; Revision Date/Note: *; Price Break: *; Opt. Temp.: *; Features: *
C102 C104 C105 = CAP-C1608X5R1A226M080AC: ±20% 10V Ceramic Capacitor X5R 0603 (1608 Metric); Manufacturer-1: Murata Electronics; Manufacturer Part Number-1: C1608X5R1A226M080AC; Footprint: 0603; Manufacturer-2: *; Manufacturer Part Number-2: *; Inventron Stock No: *; Created By: E.E; Created Date: 2.11.2020; Checked By: *; ASSY_OPT: *; Dimensions: *; Unit Price: *; Revision Date/Note: *; Price Break: *; Opt. Temp.: *; Class: Capacitor; Features: *
CON100 CON101 = CON-DF40C-100DS-0.4V(51): CONN HDR 100POS 0.4MM SMD GOLD; Manufacturer-1: HIROSE; Class: Connector; Manufacturer Part Number-1: DF40C-100DS-0.4V(51); Footprint: 100POS 0.4MM; Manufacturer-2: *; Manufacturer Part Number-2: *; Inventron Stock No: *; Created By: EE; Created Date: 18.11.2020; Checked By: *; ASSY_OPT: *; Dimensions: *; Unit Price: 0.85; Revision Date/Note: *; Price Break: 5K
CON102 = CON-DF40C-20DS-0.4V(51): CONN RCPT 20POS SMD GOLD; Manufacturer-1: Hirose Electric Co Ltd; Class: Connector; Manufacturer Part Number-1: DF40C-20DS-0.4V(51); Footprint: 2X10; Manufacturer-2: *; Manufacturer Part Number-2: *; Inventron Stock No: *; Created By: E.E; Created Date: 8.10.2020; Checked By: *; ASSY_OPT: *; Dimensions: *; Unit Price: 0.27550; Revision Date/Note: *; Price Break: 5000; Opt. Temp.: *; Features: *
CON103 = CON-10 PIN 2.54MM TH: 10 PIN 1.27 SMD; Class: Connector; Manufacturer Part Number-1: *; Footprint: *; Manufacturer-1: *; Manufacturer-2: *; Manufacturer Part Number-2: *; Inventron Stock No: *; Created By: *; Created Date: *; Checked By: *; Dimensions: *; Unit Price: *; Revision Date/Note: *; Price Break: *; Opt. Temp.: *
CON104 CON106 CON107 = CON-9774030151R: RND STANDOFF M2X0.4 STEEL 2.5MM; Manufacturer-1: Würth Elektronik; Class: Connector; Manufacturer Part Number-1: 9774030151R; Footprint: *; Manufacturer-2: *; Manufacturer Part Number-2: *; Inventron Stock No: *; Created By: *; Created Date: *; Checked By: *; ASSY_OPT: *; Dimensions: *; Unit Price: 0.7; Revision Date/Note: *; Price Break: 700; Opt. Temp.: *; Features: *
D100 = LED-LTST-C190KRKT: LED SMD 0603 SUPER GREEN; Manufacturer-1: LITEON; Manufacturer Part Number-1: LTST-C190KRKT; Footprint: *; Manufacturer-2: *; Manufacturer Part Number-2: *; Inventron Stock No: *; Created By: *; Created Date: *; Checked By: *; ASSY_OPT: *; Dimensions: *; Unit Price: 0.03343; Revision Date/Note: *; Price Break: 4000; Opt. Temp.: *; Class: Led; Features: *
D101 D102 = DIODE-RB520S30T1G: DIODE SCHOTTKY 30V 200MA SOD523; Manufacturer-1: ON SEMI; Opt. Temp.: -55/+150; Manufacturer Part Number-1: RB520S30T1G; Footprint: SOD-523; Manufacturer-2: *; Manufacturer Part Number-2: *; Inventron Stock No: *; Created By: LA; Created Date: 23.11.2018; Checked By: *; Dimensions: *; Unit Price: 0,0324; Revision Date/Note: *; Price Break: 3K; Class: Diode
FD100-FD105 = FD: Manufacturer Part Number-1: "; Footprint: "; Manufacturer-1: "; Manufacturer-2: *; Manufacturer Part Number-2: *; Inventron Stock No: *; Created By: "; Created Date: "; Checked By: *; ASSY_OPT: *; Dimensions: *; Unit Price: "; Revision Date/Note: *; Price Break: "; Opt. Temp.: "; Class: "
L104-L107 = IND-FERRITE (RES 0 OHM) 0402: 0OHM 0402; Manufacturer Part Number-1: RMCF0402ZT0R00; Manufacturer-1: Stackpole Electronics Inc; Class: Inductor; Footprint: 0402; Manufacturer-2: *; Inventron Stock No: *; Created By: EE; Checked By: *; ASSY_OPT: *; Dimensions: *; Unit Price: 0.00186; Revision Date/Note: *; Price Break: 1000
M100-M103 = CON-M3 SCREW: M3 SCREW
R100 R102-R106 = RES-4.7K: RES 4.7K OHM 5% 1/16W 0402; Manufacturer Part Number-1: RC0402JR-074K7L; Manufacturer-1: Yageo; Opt. Temp.: -55/+155; Class: Resistor; Footprint: 0402; Manufacturer-2: *; Manufacturer Part Number-2: *; Inventron Stock No: *; Created By: LA; Checked By: *; ASSY_OPT: *; Dimensions: *; Revision Date/Note: *
R101 = RES-RMCF0402JT1K00: RES 1K OHM 5% 1/16W 0402; Manufacturer-1: STACKPOLE; Opt. Temp.: -55/+155; Class: Resistor; Manufacturer Part Number-1: RMCF0402JT1K00; Footprint: 0402; Manufacturer-2: *; Manufacturer Part Number-2: *; Inventron Stock No: *; Created By: LA; Created Date: 23.11.2018; Checked By: *; ASSY_OPT: *; Dimensions: *; Unit Price: 0,00127; Revision Date/Note: *; Price Break: 10K
R111-R114 R116 = RES-CRGCQ0402J330R: 330 ±5% 0.063W, 1/16W Chip Resistor 0402 (1005 Metric) Automotive AEC-Q200, Moisture Resistant Thick Film; Manufacturer-1: TE Connectivity Passive Product; Opt. Temp.: -55°C ~ 155°C; Tolerance: %5; Manufacturer Part Number-1: CRGCQ0402J330R; Footprint: 0402; Manufacturer-2: *; Manufacturer Part Number-2: *; Inventron Stock No: *; Created By: E.E; Created Date: 23.10.2020; Checked By: *; ASSY_OPT: *; Dimensions: *; Unit Price: *; Revision Date/Note: *; Price Break: *; Class: Resistor
R115 R124-R126 = RES-RMCF0402ZT0R00: RES 0 OHM JUMPER 1/16W 0402; Manufacturer-1: STACKPOLE; Opt. Temp.: -55/+155; Class: Resistor; Manufacturer Part Number-1: RMCF0402ZT0R00; Footprint: 0402; Manufacturer-2: *; Manufacturer Part Number-2: *; Inventron Stock No: *; Created By: LA; Created Date: 23.11.2018; Checked By: *; Dimensions: *; Unit Price: 0,00127; Revision Date/Note: *; Price Break: 10K
  R115: ASSY_OPT: *
R117 = RES-CRGCQ0402F2K2: 2.2 ±1% 0.063W, 1/16W Chip Resistor 0402 (1005 Metric) Automotive AEC-Q200, Moisture Resistant Thick Film; Manufacturer-1: TE Connectivity Passive Product; Opt. Temp.: -55°C ~ 155°C; Manufacturer Part Number-1: CRGCQ0402F2K2; Footprint: 0402; Manufacturer-2: *; Manufacturer Part Number-2: *; Inventron Stock No: *; Created By: E.E; Created Date: 22.10.2020; Checked By: *; ASSY_OPT: *; Dimensions: *; Unit Price: *; Revision Date/Note: *; Price Break: *; Class: Resistor; Tolerance: *
R120-R122 = RES-RMCF0402JT10K0: RES 10K OHM 5% 1/16W 0402; Manufacturer-1: STACKPOLE; Opt. Temp.: -55/+155; Class: Resistor; Manufacturer Part Number-1: RMCF0402JT10K0; Footprint: 0402; Manufacturer-2: *; Manufacturer Part Number-2: *; Inventron Stock No: *; Created By: LA; Created Date: 23.11.2018; Checked By: *; Dimensions: *; Unit Price: 0,00127; Revision Date/Note: *; Price Break: 10K
R123 = RES-RMCF0603FT100R: RES 100 OHM %1 1/10W 0603; Manufacturer-1: STACKPOLE; Opt. Temp.: -55/+155; Class: Resistor; Manufacturer Part Number-1: RMCF0603FT100R; Footprint: 0603; Manufacturer-2: *; Manufacturer Part Number-2: *; Inventron Stock No: *; Created By: LA; Created Date: *; Checked By: *; Dimensions: *; Unit Price: *; Revision Date/Note: *; Price Break: *; Features: AUTOMOTIVE; Tolerance: *

## Sheet 07 MIPI CSI.SchDoc
size A4; SheetNumber: 9; SheetTotal: 11
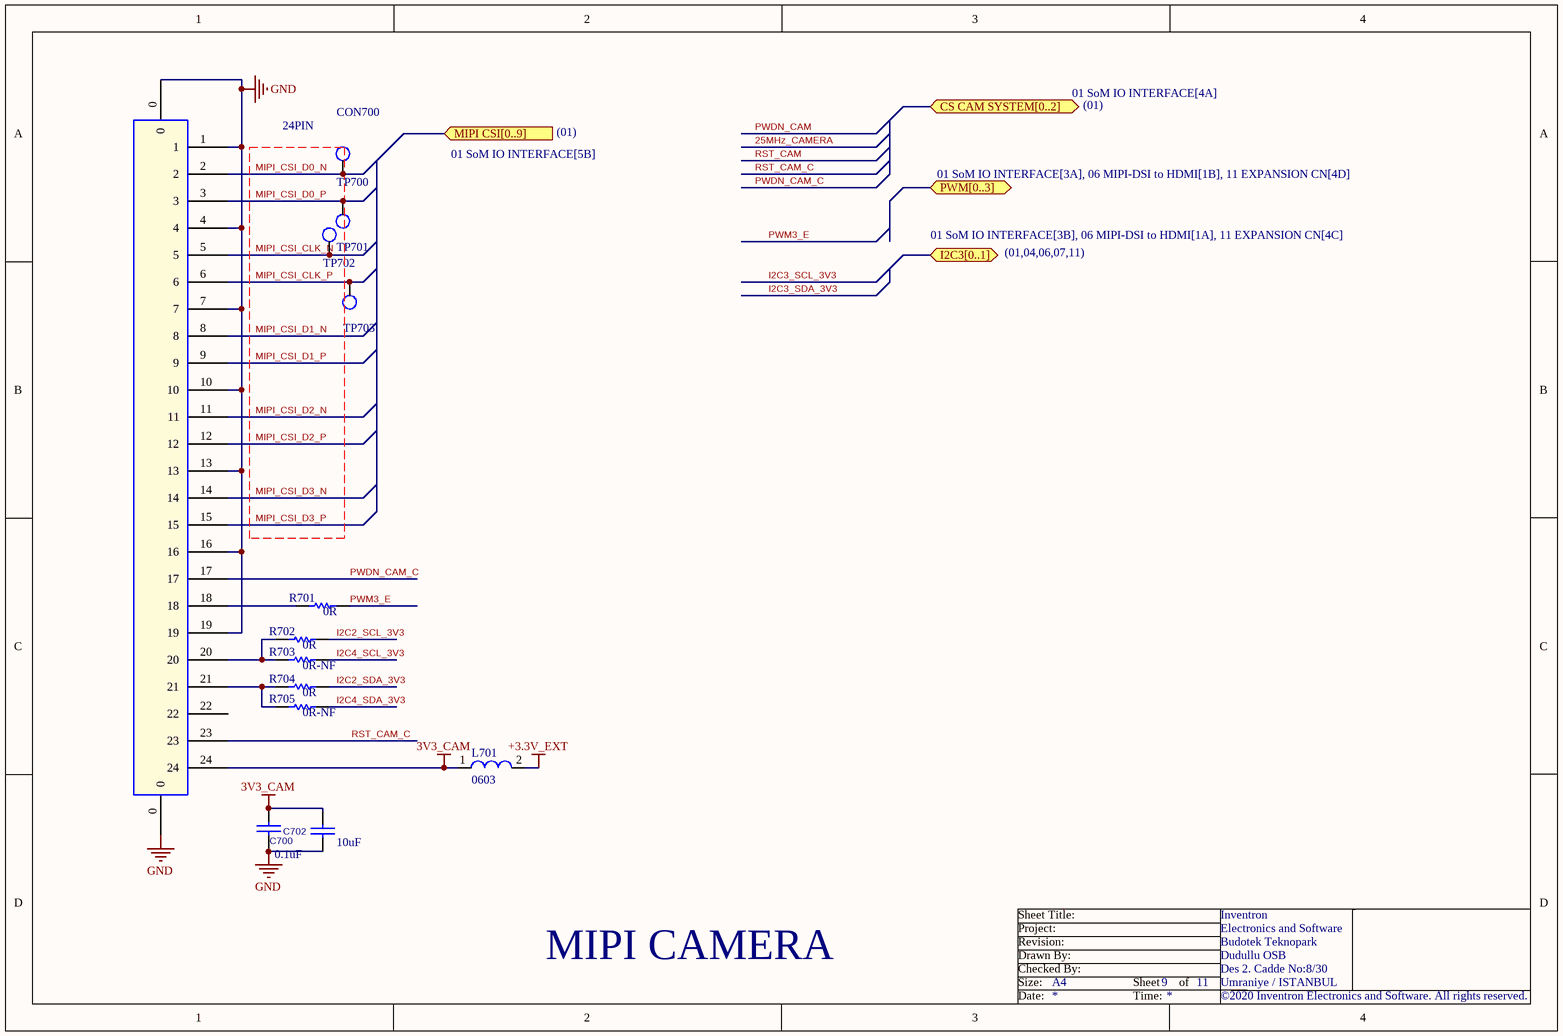
[diagram p5: 07 MIPI CSI.SchDoc]

### Parts
C700  0.1uF  [0402_CC]
C702  10uF  [0603_CC]
CON700  24PIN  [24-PIN FPC]
L701  0603  [0603_RES]
R701  0R  [0402_RES]
R702  0R  [0402_RES]
R703  0R-NF  [0402_RES]  (no BOM)
R704  0R  [0402_RES]
R705  0R-NF  [0402_RES]  (no BOM)
TP700  TEST POINT 15  [testpoint_15]  (value not drawn)  (no BOM)
TP701  TEST POINT 15  [testpoint_15]  (value not drawn)  (no BOM)
TP702  TEST POINT 15  [testpoint_15]  (value not drawn)  (no BOM)
TP703  TEST POINT 15  [testpoint_15]  (value not drawn)  (no BOM)

### Ports
CS CAM SYSTEM[0..2] (bidir, see 01 SoM IO INTERFACE[4A]), I2C3[0..1] (bidir, see 01 SoM IO INTERFACE[3B], 06 MIPI-DSI to HDMI[1A], 11 EXPANSION CN[4C]), MIPI CSI[0..9] (in, see 01 SoM IO INTERFACE[5B]), PWM[0..3] (bidir, see 01 SoM IO INTERFACE[3A], 06 MIPI-DSI to HDMI[1B], 11 EXPANSION CN[4D])

### Nets
3V3_CAM: C700.1 C702.1 CON700.24 L701.1
+3.3V_EXT: L701.2
GND: C700.2 C702.2 CON700.0 CON700.1 CON700.4 CON700.7 CON700.10 CON700.13 CON700.16 CON700.19
I2C2_SCL_3V3: R702.2
I2C2_SDA_3V3: R704.2
I2C4_SCL_3V3: R703.2
I2C4_SDA_3V3: R705.2
MIPI_CSI_CLK_N: CON700.5 TP702.1
MIPI_CSI_CLK_P: CON700.6 TP703.1
MIPI_CSI_D0_N: CON700.2 TP700.1
MIPI_CSI_D0_P: CON700.3 TP701.1
MIPI_CSI_D1_N: CON700.8
MIPI_CSI_D1_P: CON700.9
MIPI_CSI_D2_N: CON700.11
MIPI_CSI_D2_P: CON700.12
MIPI_CSI_D3_N: CON700.14
MIPI_CSI_D3_P: CON700.15
PWDN_CAM_C: CON700.17
PWM3_E: R701.2
RST_CAM_C: CON700.23
NetCON700_18: CON700.18 R701.1
NetCON700_20: CON700.20 R702.1 R703.1
NetCON700_21: CON700.21 R704.1 R705.1

Not connected (* = marked no-connect by the designer): CON700 22

### Notes on the sheet
- (01)
- (01,04,06,07,11)
- MIPI CAMERA
- Sheet Title:
- Inventron
- Size:
- Drawn By:
- Revision:
- Project:
- Checked By:
- A4
- Sheet
- of
- Budotek Teknopark
- Dudullu OSB
- Des 2. Cadde No:8/30
- Umraniye / ISTANBUL
- Electronics and Software
- Date:
- Time:
- ©2020 Inventron Electronics and Software. All rights reserved.

### Library data of the parts
C700 = CAP-CL05B104KO5NNNC: CAP VER 0.1UF 16V X7R 0402; Manufacturer-1: SAMSUNG; Opt. Temp.: -55/+125; Class: Capacitor; Manufacturer Part Number-1: CL05B104KO5NNNC; Footprint: 0402; Manufacturer-2: *; Manufacturer Part Number-2: *; Inventron Stock No: *; Created By: LA; Created Date: 23.11.2018; Checked By: *; ASSY_OPT: *; Dimensions: *; Unit Price: 0,00499; Revision Date/Note: *; Price Break: 10K
C702 = CAP-JMK107BC6106MA-T: CAP CER 10UF 6.3V X6S 0603; Manufacturer-1: TAIYO YUDEN; Opt. Temp.: -55/+105; Class: Capacitor; Manufacturer Part Number-1: JMK107BC6106MA-T; Footprint: 0603; Manufacturer-2: *; Manufacturer Part Number-2: *; Inventron Stock No: *; Created By: LA; Created Date: 23.11.2018; Checked By: *; ASSY_OPT: *; Dimensions: *; Unit Price: 0,044; Revision Date/Note: *; Price Break: 4K
CON700 = CON-SFV24R-4STBE1HLF(GENIS): CONN FPC TOP 24POS 0.50MM R/A; Manufacturer-1: AMPHENOL; Opt. Temp.: -55/+105; Class: Connector; Manufacturer Part Number-1: SFV24R-4STBE1HLF; Footprint: *; Manufacturer-2: *; Manufacturer Part Number-2: *; Inventron Stock No: *; Created By: LA; Created Date: 06.05.2019; Checked By: *; ASSY_OPT: *; Dimensions: *; Unit Price: 0,19575; Revision Date/Note: *; Price Break: 3K
L701 = IND-FERRITE (RES 0 OHM) 0603: 0OHM 0603; Manufacturer Part Number-1: RC0603JR-070RL; Manufacturer-1: YAGEO; Class: Inductor; Footprint: 0603; Manufacturer-2: *; Inventron Stock No: *; Created By: EE; Checked By: *; ASSY_OPT: *; Dimensions: *; Revision Date/Note: *
R701-R705 = RES-RMCF0402ZT0R00: as R115 on sheet 01 SoM IO INTERFACE; Manufacturer Part Number-1: RMCF0402ZT0R00; Footprint: 0402; Manufacturer-2: *; Manufacturer Part Number-2: *; Inventron Stock No: *; Created By: LA; Created Date: 23.11.2018; Checked By: *; ASSY_OPT: *; Dimensions: *; Unit Price: 0,00127; Revision Date/Note: *; Price Break: 10K

## Sheet 08 USB OTG & POWER.SchDoc
size A3
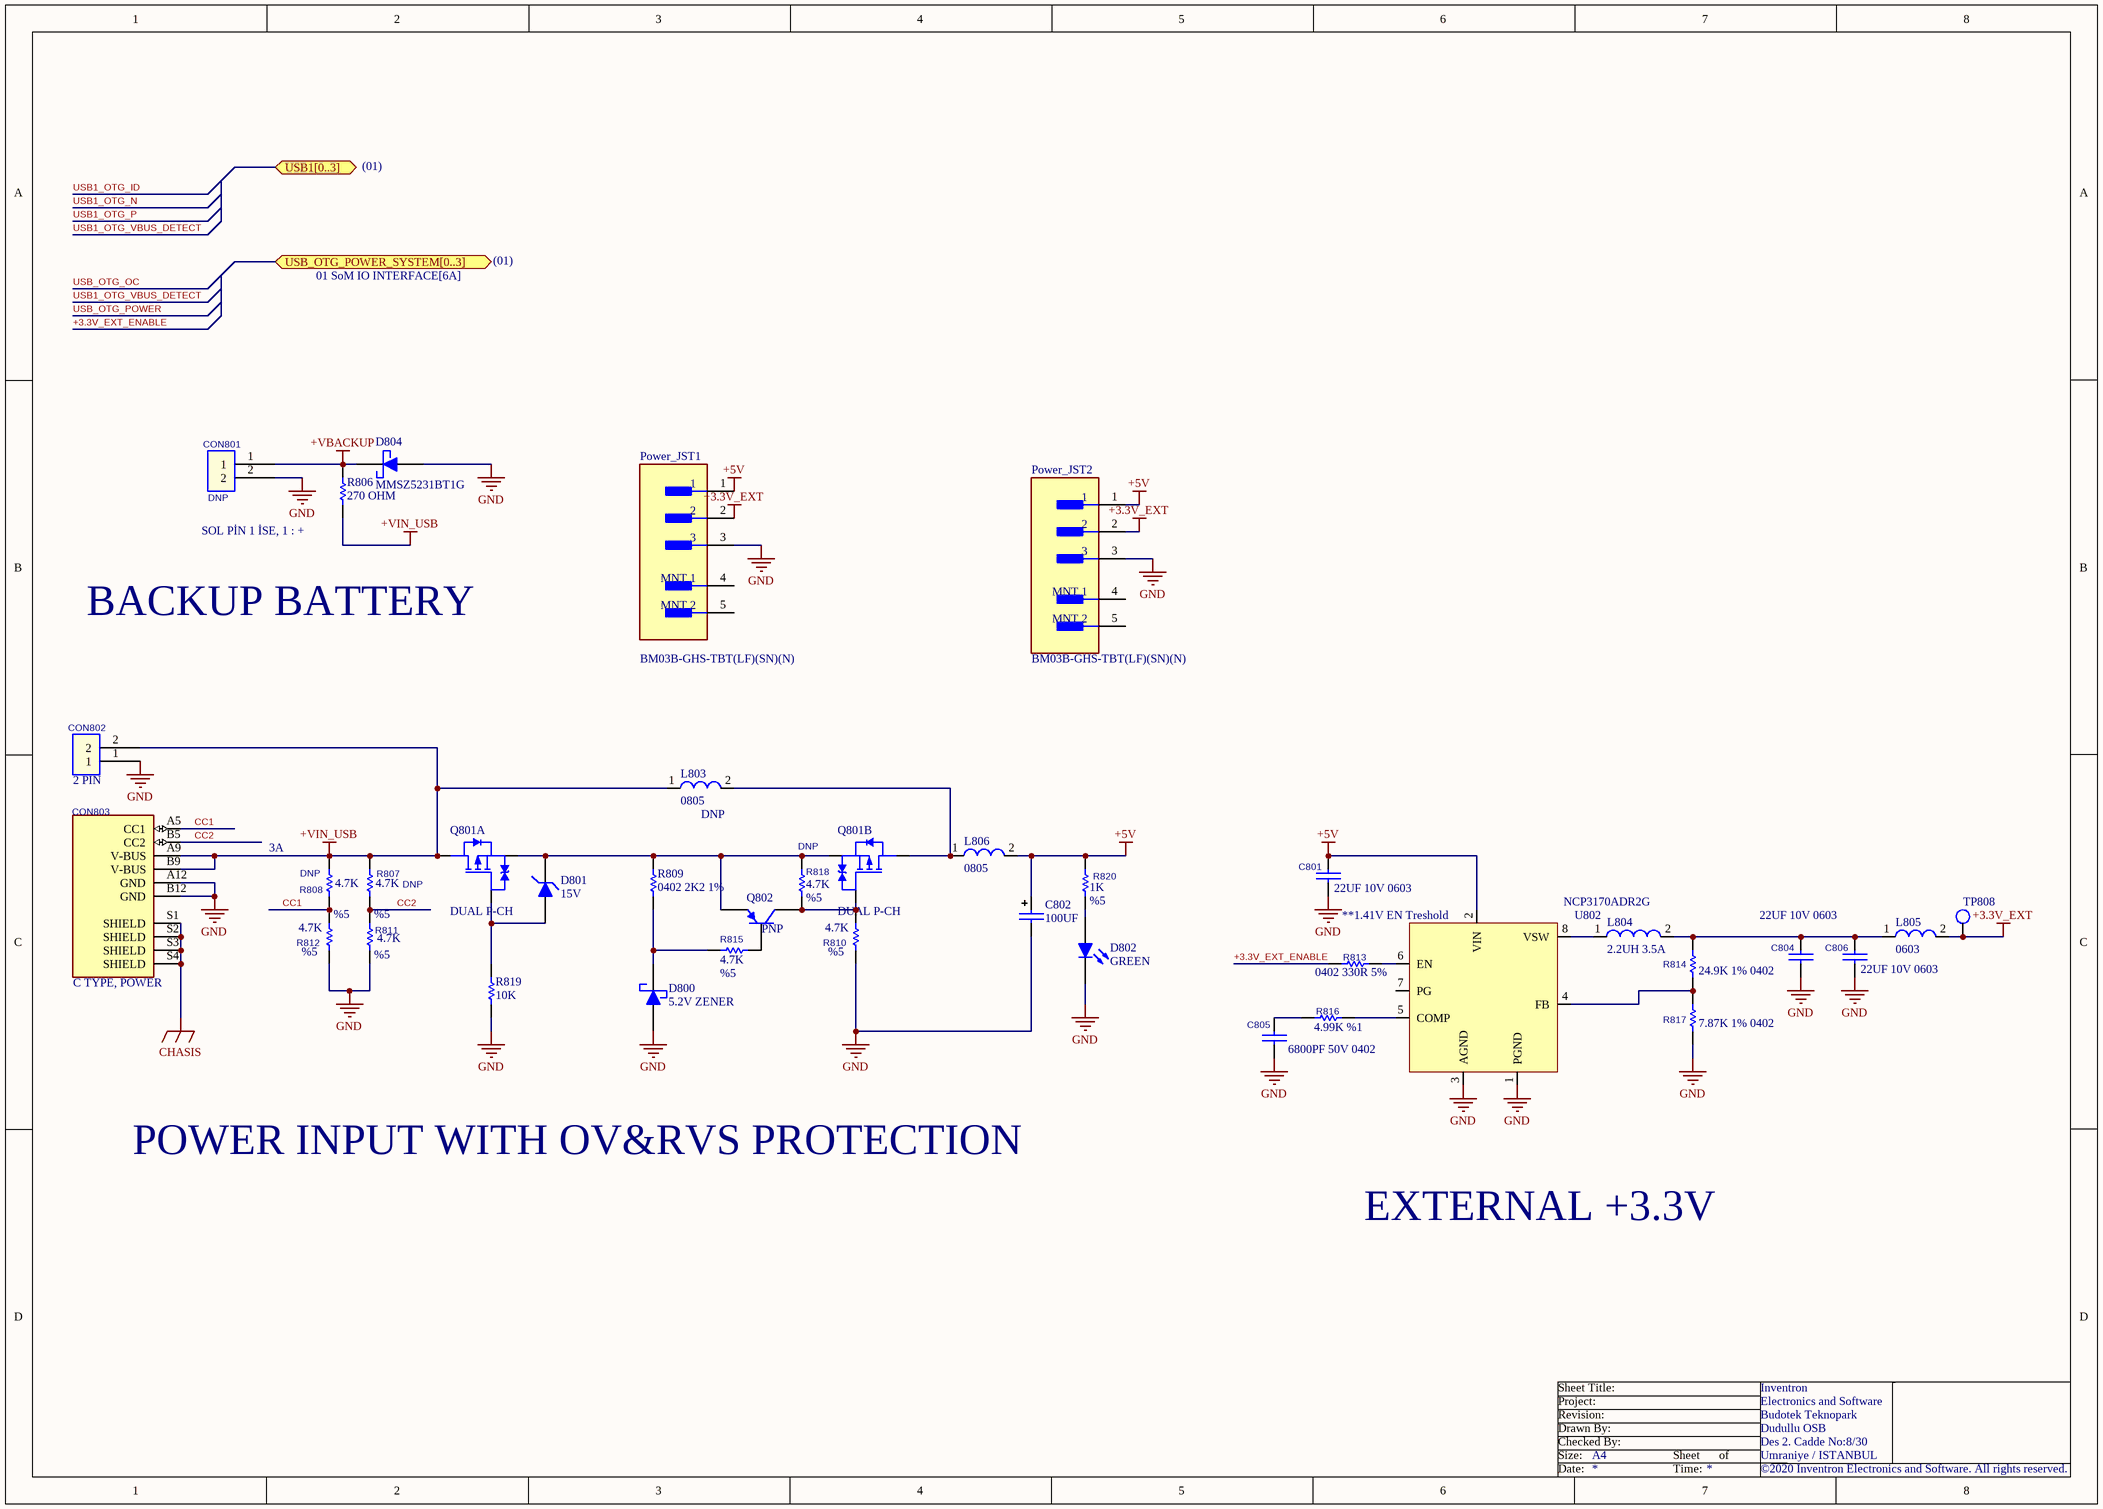
[diagram p6: 08 USB OTG & POWER.SchDoc]

### Parts
C801  22UF 10V 0603  [0603_CC]
C802  100UF  [UWR1A101MCL1GB]
C804  22UF 10V 0603  [0603_CC]
C805  6800PF 50V 0402  [0402_CC]
C806  22UF 10V 0603  [0603_CC]
CON801  ASSY_OPT: DNP  [B2B-PH-K-S]  (hidden comment: CON-B2B-PH-K-S(LF)(SN))
CON802  2 PIN  [640456-2]
CON803  C TYPE, POWER  [CUI_UJC-HP-3-SMT-TR]
D800  5.2V ZENER  [SOD-323]
D801  15V  [SOD-323]
D802  GREEN  [0603_LED]
D804  MMSZ5231BT1G  [SOD-123]  (no BOM)
L803  0805  ASSY_OPT: DNP  [0805]  (no BOM)
L804  2.2UH 3.5A  [IND-NRS5030T2R2NMGJ]
L805  0603  [0603_RES]
L806  0805  [0805]
Power_JST1  BM03B-GHS-TBT(LF)(SN)(N)  [FP-BM03B-GHS-TBT_LF_SN-MFG]
Power_JST2  BM03B-GHS-TBT(LF)(SN)(N)  [FP-BM03B-GHS-TBT_LF_SN-MFG]
Q801  DUAL P-CH  [SO-8 - DUAL MOS - NAMED]  (parts A,B of 2)
Q802  PNP  [SOT23]
R806  270 OHM  [0603_RES]  (no BOM)
R807  4.7K  ASSY_OPT: DNP  Tolerance: %5  [0402_RES]
R808  4.7K  ASSY_OPT: DNP  Tolerance: %5  [0402_RES]
R809  0402 2K2 1%  [0402_RES]
R810  4.7K  Tolerance: %5  [0402_RES]
R811  4.7K  Tolerance: %5  [0402_RES]
R812  4.7K  Tolerance: %5  [0402_RES]
R813  0402 330R 5%  [0402_RES]
R814  24.9K 1% 0402  [0402_RES]
R815  4.7K  Tolerance: %5  [0402_RES]
R816  4.99K %1  [0603_RES]
R817  7.87K 1% 0402  [0402_RES]
R818  4.7K  ASSY_OPT: DNP  Tolerance: %5  [0402_RES]  (no BOM)
R819  10K  [0805]
R820  1K  Tolerance: %5  [0402_RES]
TP808  TEST POINT 35  [testpoint_35mil]  (value not drawn)  (no BOM)
U802  NCP3170ADR2G  [IC-NCP3170ADR2G]

### Ports
USB1[0..3] (bidir), USB_OTG_POWER_SYSTEM[0..3] (bidir, see 01 SoM IO INTERFACE[6A])

### Nets
+3.3V_EXT: L805.2 Power_JST1.2 Power_JST2.2 TP808.1
+5V: C801.1 C802.1 L806.2 Power_JST1.1 Power_JST2.1 R820.1 U802.2(VIN)
+VBACKUP: CON801.1 D804.K R806.1
+VIN_USB: CON802.2 CON803.A9(V-BUS) CON803.B9(V-BUS) L803.1 Q801.D1 R806.2 R807.1 R808.1
CHASIS: CON803.S1(SHIELD) CON803.S2(SHIELD) CON803.S3(SHIELD) CON803.S4(SHIELD)
GND: C801.2 C802.2 C804.2 C805.2 C806.2 CON801.2 CON802.1 CON803.A12(GND) CON803.B12(GND) D800.A D802.2(K) D804.A Power_JST1.3 Power_JST2.3 R810.2 R811.2 R812.2 R817.1 R819.1 U802.1(PGND) U802.3(AGND)
+3.3V_EXT_ENABLE: R813.1
CC1: CON803.A5(CC1) R808.2 R812.1
CC2: CON803.B5(CC2) R807.2 R811.1
NetC804_1: C804.1 C806.1 L804.2 L805.1 R814.2
NetC805_1: C805.1 R816.1
NetD800_K: D800.K R809.1 R815.1
NetD801_A: D801.A Q801.G1 R819.2
NetD801_K: D801.K Q801.S1 Q801.S2 Q802.2(E) R809.2 R818.2
NetD802_1: D802.1(A) R820.2
NetL803_2: L803.2 L806.1 Q801.D2
NetL804_1: L804.1 U802.8(VSW)
NetQ801_G2: Q801.G2 Q802.3(C) R810.1 R818.1
NetQ802_1: Q802.1(B) R815.2
NetR813_2: R813.2 U802.6(EN)
NetR814_1: R814.1 R817.2 U802.4(FB)
NetR816_2: R816.2 U802.5(COMP)

Not connected (* = marked no-connect by the designer): Power_JST1 4(MNT_1) 5(MNT_2); Power_JST2 4(MNT_1) 5(MNT_2); U802 7(PG)

### Notes on the sheet
- (01)
- (near R806) SOL PİN 1 İSE, 1 : +
- BACKUP BATTERY
- (near R808) 3A
- (near U802) **1.41V EN Treshold
- POWER INPUT WITH OV&RVS PROTECTION
- EXTERNAL +3.3V
- Sheet Title:
- Inventron
- Size:
- Drawn By:
- Revision:
- Project:
- Checked By:
- A4
- Sheet
- of
- Budotek Teknopark
- Dudullu OSB
- Des 2. Cadde No:8/30
- Umraniye / ISTANBUL
- Electronics and Software
- Date:
- Time:
- ©2020 Inventron Electronics and Software. All rights reserved.

### Library data of the parts
C801 C804 C806 = CAP-C1608X5R1A226M080AC: as C102 on sheet 01 SoM IO INTERFACE; Manufacturer Part Number-1: C1608X5R1A226M080AC; Footprint: 0603; Manufacturer-2: *; Manufacturer Part Number-2: *; Inventron Stock No: *; Created By: E.E; Created Date: 2.11.2020; Checked By: *; ASSY_OPT: *; Dimensions: *; Unit Price: *; Revision Date/Note: *; Price Break: *; Opt. Temp.: *; Class: Capacitor; Features: *
C802 = CAP-UWR1A101MCL1GB: CAP ALUM 100UF 20% 10V SMD; Manufacturer-1: Nichicon; Class: Capacitor; Manufacturer Part Number-1: UWR1A101MCL1GB; Footprint: *; Manufacturer-2: *; Manufacturer Part Number-2: *; Inventron Stock No: *; Created By: EE; Created Date: *; Checked By: *; ASSY_OPT: *; Dimensions: *; Unit Price: 0.05481; Revision Date/Note: *; Price Break: 1000; Opt. Temp.: *; Features: *
C805 = CAP-CL05B682KB5NNNC: 6800pF ±10% 50V Ceramic Capacitor X7R 0402 (1005 Metric); Manufacturer-1: Samsung Electro-Mechanics; Manufacturer Part Number-1: CL05B682KB5NNNC; Footprint: 0402; Manufacturer-2: *; Manufacturer Part Number-2: *; Inventron Stock No: *; Created By: E.E; Created Date: 15.11.2020; Checked By: *; ASSY_OPT: *; Dimensions: *; Unit Price: *; Revision Date/Note: *; Price Break: *; Opt. Temp.: *; Class: Capacitor; Features: *
CON801 = CON-B2B-PH-K-S(LF)(SN): CONN HEADER VERT 2POS 2MM; Manufacturer-1: JST; Class: Connector; Manufacturer Part Number-1: B2B-PH-K-S(LF)(SN); Footprint: *; Manufacturer-2: *; Manufacturer Part Number-2: *; Inventron Stock No: *; Created By: LA; Created Date: 16.05.2019; Checked By: *; Dimensions: *; Unit Price: 0,072; Revision Date/Note: *; Price Break: 1K; Opt. Temp.: *
CON802 = CON-640456-2: CONN HEADER VERT 2POS 2.54MM; Manufacturer-1: TE; Class: Connector; Manufacturer Part Number-1: 640456-2; Footprint: *; Manufacturer-2: *; Manufacturer Part Number-2: *; Inventron Stock No: *; Created By: LA; Created Date: 16.05.2019; Checked By: *; ASSY_OPT: *; Dimensions: *; Unit Price: 0,048; Revision Date/Note: *; Price Break: 1K; Opt. Temp.: *
CON803 = 0-CON-UJC-HP-3-SMT-TR: USB JACK, C TYPE, POWER ONLY, 6; Manufacturer-1: CUI Devices; Opt. Temp.: -40°C ~ 80°C; Class: Connector; Manufacturer Part Number-1: UJC-HP-3-SMT-TR; Footprint: C TYPE, POWER ONLY, 6; Manufacturer-2: *; Manufacturer Part Number-2: *; Inventron Stock No: *; Created By: E.E; Created Date: 30.10.2020; Checked By: *; ASSY_OPT: *; Dimensions: *; Unit Price: 0.360; Revision Date/Note: *; Price Break: *; Features: *
D800 = DIODE-PZU5.1B2A,115: DIODE ZENER 5.1V 320MW SOD323; Manufacturer-1: Nexperia USA Inc.; Manufacturer Part Number-1: PZU5.1B2A,115; Manufacturer-2: *; Manufacturer Part Number-2: *; Inventron Stock No: *; Created By: EE; Checked By: *; ASSY_OPT: *; Dimensions: *; Revision Date/Note: *; Class: Diode
D801 = DIODE-PDZ15B,115: DIODE ZENER 15V 400MW SOD323; Manufacturer-1: Nexperia USA Inc.; Manufacturer Part Number-1: PDZ15B,115; Footprint: *; Manufacturer-2: *; Manufacturer Part Number-2: *; Inventron Stock No: *; Created By: LA; Created Date: *; Checked By: *; ASSY_OPT: *; Dimensions: *; Revision Date/Note: *; Opt. Temp.: *; Class: Diode
D802 = LED-LTST-C190KRKT: as D100 on sheet 01 SoM IO INTERFACE; Manufacturer Part Number-1: LTST-C190KRKT; Footprint: *; Manufacturer-2: *; Manufacturer Part Number-2: *; Inventron Stock No: *; Created By: *; Created Date: *; Checked By: *; ASSY_OPT: *; Dimensions: *; Unit Price: 0.03343; Revision Date/Note: *; Price Break: 4000; Opt. Temp.: *; Class: Led; Features: *
D804 = DIODE-MMSZ5231BT1G: DIODE ZENER 5.1V 500MW SOD123; Manufacturer-1: ON Semiconductor; ASSY_OPT: DNP; Manufacturer Part Number-1: MMSZ5231BT1G; Manufacturer-2: *; Manufacturer Part Number-2: *; Inventron Stock No: *; Created By: EE; Checked By: *; Dimensions: *; Revision Date/Note: *; Class: Diode
L803 L806 = IND-FERRITE (RES 0 OHM) 0805: 0OHM 0805; Manufacturer Part Number-1: AC0805JR-070RL; Manufacturer-1: YAGEO; Class: Inductor; Manufacturer-2: *; Inventron Stock No: *; Created By: EE; Checked By: *; Dimensions: *; Revision Date/Note: *
  L806: ASSY_OPT: *
L804 = IND-NRS5030T2R2NMGJ: Shielded Wirewound Inductor 23mOhm Nonstandard; Manufacturer-1: Taiyo Yuden; Manufacturer Part Number-1: NRS5030T2R2NMGJ; Footprint: *; Manufacturer-2: *; Manufacturer Part Number-2: *; Inventron Stock No: *; Created By: E.E; Created Date: 3.11.2020; Checked By: *; ASSY_OPT: *; Dimensions: *; Unit Price: *; Revision Date/Note: *; Price Break: *; Opt. Temp.: *; Class: Inductor; Features: *
L805 = IND-FERRITE (RES 0 OHM) 0603: as L701 on sheet 07 MIPI CSI; Footprint: 0603; Manufacturer-2: *; Inventron Stock No: *; Created By: EE; Checked By: *; ASSY_OPT: *; Dimensions: *; Revision Date/Note: *
Power_JST1 Power_JST2 = CMP-17439-000058-1: CONN HEADER SMD 3POS 1.25MM; Pitch: 0.049inch; Number of Positions: 3; Contact Finish - Mating: TIN; Lead Free: Lead Free; Series: GH; Fastening Type: Ramp; Number of Rows: 1; Insulation Color: Natural; Contact Material: Bronze; Insulation Material: Nylon; Min Operating Temperature: -25°C; Contact Type: Outer Shroud Contact; Max Operating Temperature: 85°C; Termination: Solder; Flammability Rating: UL94 V-0; Color: Natural; Contact Plating: Tin; Contact Shape: Rectangular; Mount: Surface Mount; Packaging: Cut Tape; Connector Type: Header
Q801 = MOS-P-DMP3028LSD-13: MOSFET 2P-CH 30V 6A SO-8; Manufacturer-1: Diodes Incorporated; Class: Transistor; Manufacturer Part Number-1: DMP3028LSD-13; Footprint: SO-8; Manufacturer-2: *; Manufacturer Part Number-2: *; Inventron Stock No: *; Created By: *; Created Date: *; Checked By: *; ASSY_OPT: *; Dimensions: *; Unit Price: *; Revision Date/Note: *; Price Break: *; Opt. Temp.: *; Features: *
Q802 = TRANSISTOR-BC856: TRANS PNP 65V 0.1A SOT-23; Manufacturer Part Number-1: BC856; Manufacturer-1: ON Semi; Footprint: *; Manufacturer-2: *; Manufacturer Part Number-2: *; Inventron Stock No: *; Created By: LA; Created Date: *; Checked By: *; ASSY_OPT: *; Dimensions: *; Unit Price: *; Revision Date/Note: *; Price Break: *; Opt. Temp.: *; Class: TRANSISTOR
R806 = RES-RC0603JR-07270RL: RES SMD 270 OHM 5% 1/10W 0603; Manufacturer-1: Yageo; ASSY_OPT: DNP; Class: Resistor; Manufacturer Part Number-1: RC0603JR-07270RL; Footprint: 0603; Manufacturer-2: *; Manufacturer Part Number-2: *; Inventron Stock No: *; Created By: EE; Created Date: *; Checked By: *; Dimensions: *; Unit Price: *; Revision Date/Note: *; Price Break: *; Opt. Temp.: *; Tolerance: *
R807 R808 R810-R812 R815 R818 = RES-4.7K: as R100 on sheet 01 SoM IO INTERFACE; Footprint: 0402; Manufacturer-2: *; Manufacturer Part Number-2: *; Inventron Stock No: *; Created By: LA; Checked By: *; Dimensions: *; Revision Date/Note: *
  R810-R812 R815: ASSY_OPT: *
R809 = RES-CRGCQ0402F2K2: as R117 on sheet 01 SoM IO INTERFACE; Manufacturer Part Number-1: CRGCQ0402F2K2; Footprint: 0402; Manufacturer-2: *; Manufacturer Part Number-2: *; Inventron Stock No: *; Created By: E.E; Created Date: 22.10.2020; Checked By: *; ASSY_OPT: *; Dimensions: *; Unit Price: *; Revision Date/Note: *; Price Break: *; Class: Resistor; Tolerance: *
R813 = RES-CRGCQ0402J330R: as R111 on sheet 01 SoM IO INTERFACE; Manufacturer Part Number-1: CRGCQ0402J330R; Footprint: 0402; Manufacturer-2: *; Manufacturer Part Number-2: *; Inventron Stock No: *; Created By: E.E; Created Date: 23.10.2020; Checked By: *; ASSY_OPT: *; Dimensions: *; Unit Price: *; Revision Date/Note: *; Price Break: *; Class: Resistor
R814 = RES-RC0402FR-0724K9L: 24.9 ±1% 0.063W, 1/16W Chip Resistor 0402 (1005 Metric) - Thick Film; Manufacturer-1: Yageo; Opt. Temp.: -55°C ~ 155°C; Manufacturer Part Number-1: RC0402FR-0724K9L; Footprint: 0402; Manufacturer-2: *; Manufacturer Part Number-2: *; Inventron Stock No: *; Created By: E.E; Created Date: 19.10.2020; Checked By: *; ASSY_OPT: *; Dimensions: *; Unit Price: *; Revision Date/Note: *; Price Break: *; Class: Resistor; Tolerance: *
R816 = RES-RC0603FR-074K99L: RES 4.99K OHM %1 1/10W 0603; Manufacturer-1: YAGEO; Opt. Temp.: -55/+155; Class: Resistor; Manufacturer Part Number-1: RC0603FR-074K99L; Footprint: 0603; Manufacturer-2: *; Manufacturer Part Number-2: *; Inventron Stock No: *; Created By: LA; Created Date: *; Checked By: *; ASSY_OPT: *; Dimensions: *; Unit Price: *; Revision Date/Note: *; Price Break: *; Tolerance: *
R817 = RES-CRCW04027K87FKED: 7.87 kOhms ±1% 0.063W, 1/16W Chip Resistor 0402 (1005 Metric) Automotive AEC-Q200 Thick Film; Manufacturer-1: Vishay Dale; Manufacturer Part Number-1: CRCW04027K87FKED; Footprint: 0402; Manufacturer-2: *; Manufacturer Part Number-2: *; Inventron Stock No: *; Created By: EE; Created Date: *; Checked By: *; ASSY_OPT: *; Dimensions: *; Unit Price: *; Revision Date/Note: *; Price Break: *; Opt. Temp.: *; Class: Resistor; Tolerance: *
R819 = RES-0805S8J0103TDE: RES SMD 10K 5% 0805; Manufacturer-1: ROYALOHM; Class: Resistor; Manufacturer Part Number-1: 0805S8J0103TDE; Manufacturer-2: *; Manufacturer Part Number-2: *; Inventron Stock No: *; Created By: *; Created Date: *; Checked By: *; ASSY_OPT: *; Dimensions: *; Unit Price: *; Revision Date/Note: *; Price Break: *; Opt. Temp.: *; Tolerance: *
R820 = RES-RMCF0402JT1K00: as R101 on sheet 01 SoM IO INTERFACE; Manufacturer Part Number-1: RMCF0402JT1K00; Footprint: 0402; Manufacturer-2: *; Manufacturer Part Number-2: *; Inventron Stock No: *; Created By: LA; Created Date: 23.11.2018; Checked By: *; ASSY_OPT: *; Dimensions: *; Unit Price: 0,00127; Revision Date/Note: *; Price Break: 10K
U802 = IC-NCP3170ADR2G: Buck Regulator, Switching, PWM, 3.0 A; Manufacturer-1: ON Semiconductor; Opt. Temp.: -40 to +85; Class: ICs; Manufacturer Part Number-1: NCP3170ADR2G; Footprint: SOIC-8; Manufacturer-2: *; Manufacturer Part Number-2: *; Inventron Stock No: *; Created By: E.E; Created Date: 16.10.2020; Checked By: *; ASSY_OPT: *; Dimensions: *; Unit Price: 0.25; Revision Date/Note: *; Price Break: 5000